# EAGLE design BUZZI-19d (EAGLE 4.15)

## Sheet 1 of 8
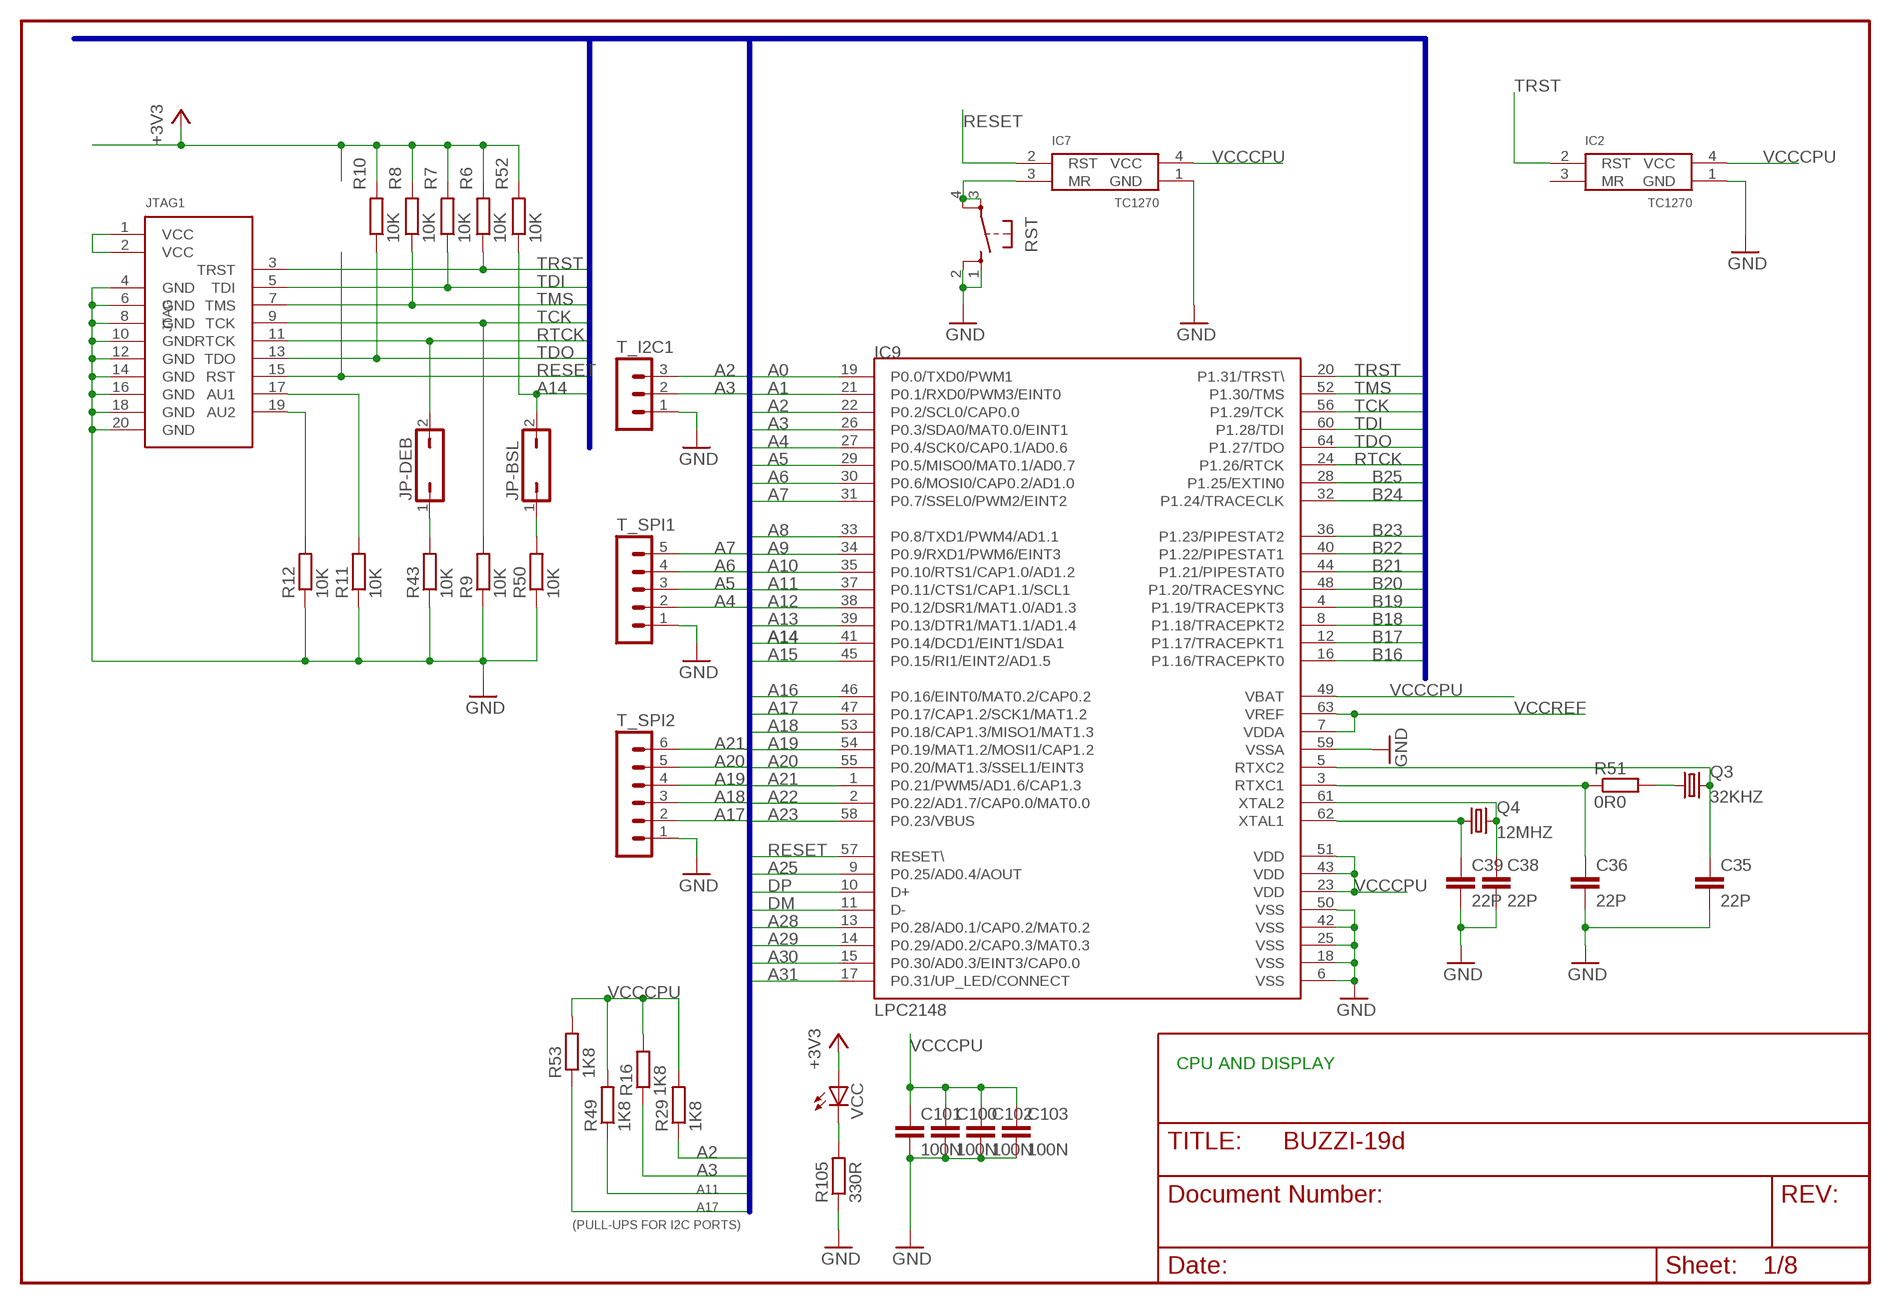
[diagram p0: schematic, sheet 1]

### Parts
C35  22P  C-EUC0805  [C0805]
C36  22P  C-EUC0805  [C0805]
C38  22P  C-EUC0805  [C0805]
C39  22P  C-EUC0805  [C0805]
C100  100N  C-EUC0805  [C0805]
C101  100N  C-EUC0805  [C0805]
C102  100N  C-EUC0805  [C0805]
C103  100N  C-EUC0805  [C0805]
IC2  TC1270  [SOT143R_INFINEON]
IC7  TC1270  [SOT143R_INFINEON]
IC9  LPC2148  LPC2148FBD64  [TSQFP50P1200X1200X160-64N]
JP-BSL  JP1Q  [JP1]
JP-DEB  JP1Q  [JP1]
JTAG1  ARM-JTAG  [ML20L]
Q3  32KHZ  CRYTALTC26V  [TC26V]
Q4  12MHZ  CRYTALHC49UP  [HC49UP]
R6  10K  R-EU_M0805  [M0805]
R7  10K  R-EU_M0805  [M0805]
R8  10K  R-EU_M0805  [M0805]
R9  10K  R-EU_M0805  [M0805]
R10  10K  R-EU_M0805  [M0805]
R11  10K  R-EU_M0805  [M0805]
R12  10K  R-EU_M0805  [M0805]
R16  1K8  R-EU_M0805  [M0805]
R29  1K8  R-EU_M0805  [M0805]
R43  10K  R-EU_M0805  [M0805]
R49  1K8  R-EU_M0805  [M0805]
R50  10K  R-EU_M0805  [M0805]
R51  0R0  R-EU_M0805  [M0805]
R52  10K  R-EU_M0805  [M0805]
R53  1K8  R-EU_M0805  [M0805]
R105  330R  R-EU_M0805  [M0805]
RST  10XX  [B3F-10XX]
T_I2C1  MA03-1  [MA03-1]
T_SPI1  MA05-1  [MA05-1]
T_SPI2  MA06-1  [MA06-1]
VCC  LEDCHIP-LED0805  [CHIP-LED0805]

### Nets
+3V3: R6.2 R7.2 R8.2 R10.2 R52.2 VCC.A ; also sheet 2,5,7,8
A0: IC9.19(P0.0/TXD0/PWM1)
A1: IC9.21(P0.1/RXD0/PWM3/EINT0) ; also sheet 7
A2: IC9.22(P0.2/SCL0/CAP0.0) R29.1 T_I2C1.3 ; also sheet 7
A3: IC9.26(P0.3/SDA0/MAT0.0/EINT1) R16.1 T_I2C1.2 ; also sheet 7
A4: IC9.27(P0.4/SCK0/CAP0.1/AD0.6) T_SPI1.2 ; also sheet 5
A5: IC9.29(P0.5/MISO0/MAT0.1/AD0.7) T_SPI1.3 ; also sheet 5
A6: IC9.30(P0.6/MOSI0/CAP0.2/AD1.0) T_SPI1.4 ; also sheet 5
A7: IC9.31(P0.7/SSEL0/PWM2/EINT2) T_SPI1.5 ; also sheet 5
A8: IC9.33(P0.8/TXD1/PWM4/AD1.1)
A9: IC9.34(P0.9/RXD1/PWM6/EINT3)
A10: IC9.35(P0.10/RTS1/CAP1.0/AD1.2)
A11: IC9.37(P0.11/CTS1/CAP1.1/SCL1) R49.1
A12: IC9.38(P0.12/DSR1/MAT1.0/AD1.3)
A13: IC9.39(P0.13/DTR1/MAT1.1/AD1.4)
A14: IC9.41(P0.14/DCD1/EINT1/SDA1) JP-BSL.2 R52.1
A15: IC9.45(P0.15/RI1/EINT2/AD1.5)
A16: IC9.46(P0.16/EINT0/MAT0.2/CAP0.2)
A17: IC9.47(P0.17/CAP1.2/SCK1/MAT1.2) R53.1 T_SPI2.2
A18: IC9.53(P0.18/CAP1.3/MISO1/MAT1.3) T_SPI2.3
A19: IC9.54(P0.19/MAT1.2/MOSI1/CAP1.2) T_SPI2.4
A20: IC9.55(P0.20/MAT1.3/SSEL1/EINT3) T_SPI2.5
A21: IC9.1(P0.21/PWM5/AD1.6/CAP1.3) T_SPI2.6
A22: IC9.2(P0.22/AD1.7/CAP0.0/MAT0.0)
A23: IC9.58(P0.23/VBUS) ; also sheet 2
A25: IC9.9(P0.25/AD0.4/AOUT)
A28: IC9.13(P0.28/AD0.1/CAP0.2/MAT0.2)
A29: IC9.14(P0.29/AD0.2/CAP0.3/MAT0.3)
A30: IC9.15(P0.30/AD0.3/EINT3/CAP0.0)
A31: IC9.17(P0.31/UP_LED/CONNECT) ; also sheet 2
B16: IC9.16(P1.16/TRACEPKT0)
B17: IC9.12(P1.17/TRACEPKT1)
B18: IC9.8(P1.18/TRACEPKT2)
B19: IC9.4(P1.19/TRACEPKT3)
B20: IC9.48(P1.20/TRACESYNC)
B21: IC9.44(P1.21/PIPESTAT0)
B22: IC9.40(P1.22/PIPESTAT1)
B23: IC9.36(P1.23/PIPESTAT2)
B24: IC9.32(P1.24/TRACECLK)
B25: IC9.28(P1.25/EXTIN0)
DM: IC9.11(D-) ; also sheet 2
DP: IC9.10(D+) ; also sheet 2
GND: C35.2 C36.2 C38.2 C39.2 C100.2 C101.2 C102.2 C103.2 IC2.1(GND) IC7.1(GND) IC9.6(VSS) IC9.18(VSS) IC9.25(VSS) IC9.42(VSS) IC9.50(VSS) IC9.59(VSSA) JTAG1.4(GND) JTAG1.6(GND) JTAG1.8(GND) JTAG1.10(GND) JTAG1.12(GND) JTAG1.14(GND) JTAG1.16(GND) JTAG1.18(GND) JTAG1.20(GND) R9.1 R11.1 R12.1 R43.1 R50.1 R105.1 RST.1 RST.2 T_I2C1.1 T_SPI1.1 T_SPI2.1 ; also sheet 2,5,7,8
JBSL: JP-BSL.1 R50.2
JDEB: JP-DEB.1 R43.2
JTAG17: JTAG1.17(AU1) R11.2
JTAG19: JTAG1.19(AU2) R12.2
MRSWITCH: IC7.3(MR) RST.3 RST.4
N$1: JTAG1.1(VCC) JTAG1.2(VCC)
RESET: IC7.2(RST) IC9.57(RESET\) JTAG1.15(RST)
RTCK: IC9.24(P1.26/RTCK) JP-DEB.2 JTAG1.11(RTCK)
RX1: C36.1 IC9.3(RTXC1) R51.1
RX2: C35.1 IC9.5(RTXC2) Q3.2
RX3: Q3.1 R51.2
TCK: IC9.56(P1.29/TCK) JTAG1.9(TCK) R9.2
TDI: IC9.60(P1.28/TDI) JTAG1.5(TDI) R7.1
TDO: IC9.64(P1.27/TDO) JTAG1.13(TDO) R10.1
TMS: IC9.52(P1.30/TMS) JTAG1.7(TMS) R8.1
TRST: IC2.2(RST) IC9.20(P1.31/TRST\) JTAG1.3(TRST) R6.1
VCCCPU: C100.1 C101.1 C102.1 C103.1 IC2.4(VCC) IC7.4(VCC) IC9.23(VDD) IC9.43(VDD) IC9.49(VBAT) IC9.51(VDD) R16.2 R29.2 R49.2 R53.2 ; also sheet 8
VCCLED: R105.2 VCC.C
VCCREF: IC9.7(VDDA) IC9.63(VREF) ; also sheet 8
X1: C39.1 IC9.62(XTAL1) Q4.1
X2: C38.1 IC9.61(XTAL2) Q4.2
Unconnected: IC2.3(MR)

### Buses
ARM7:A[0..31],B[0..31],RESET,DP,DM,TRST,TMS,TCK,TDI,TDO,RTCK

### Notes on the sheet
- CPU AND DISPLAY
- (PULL-UPS FOR I2C PORTS)

## Sheet 2 of 8
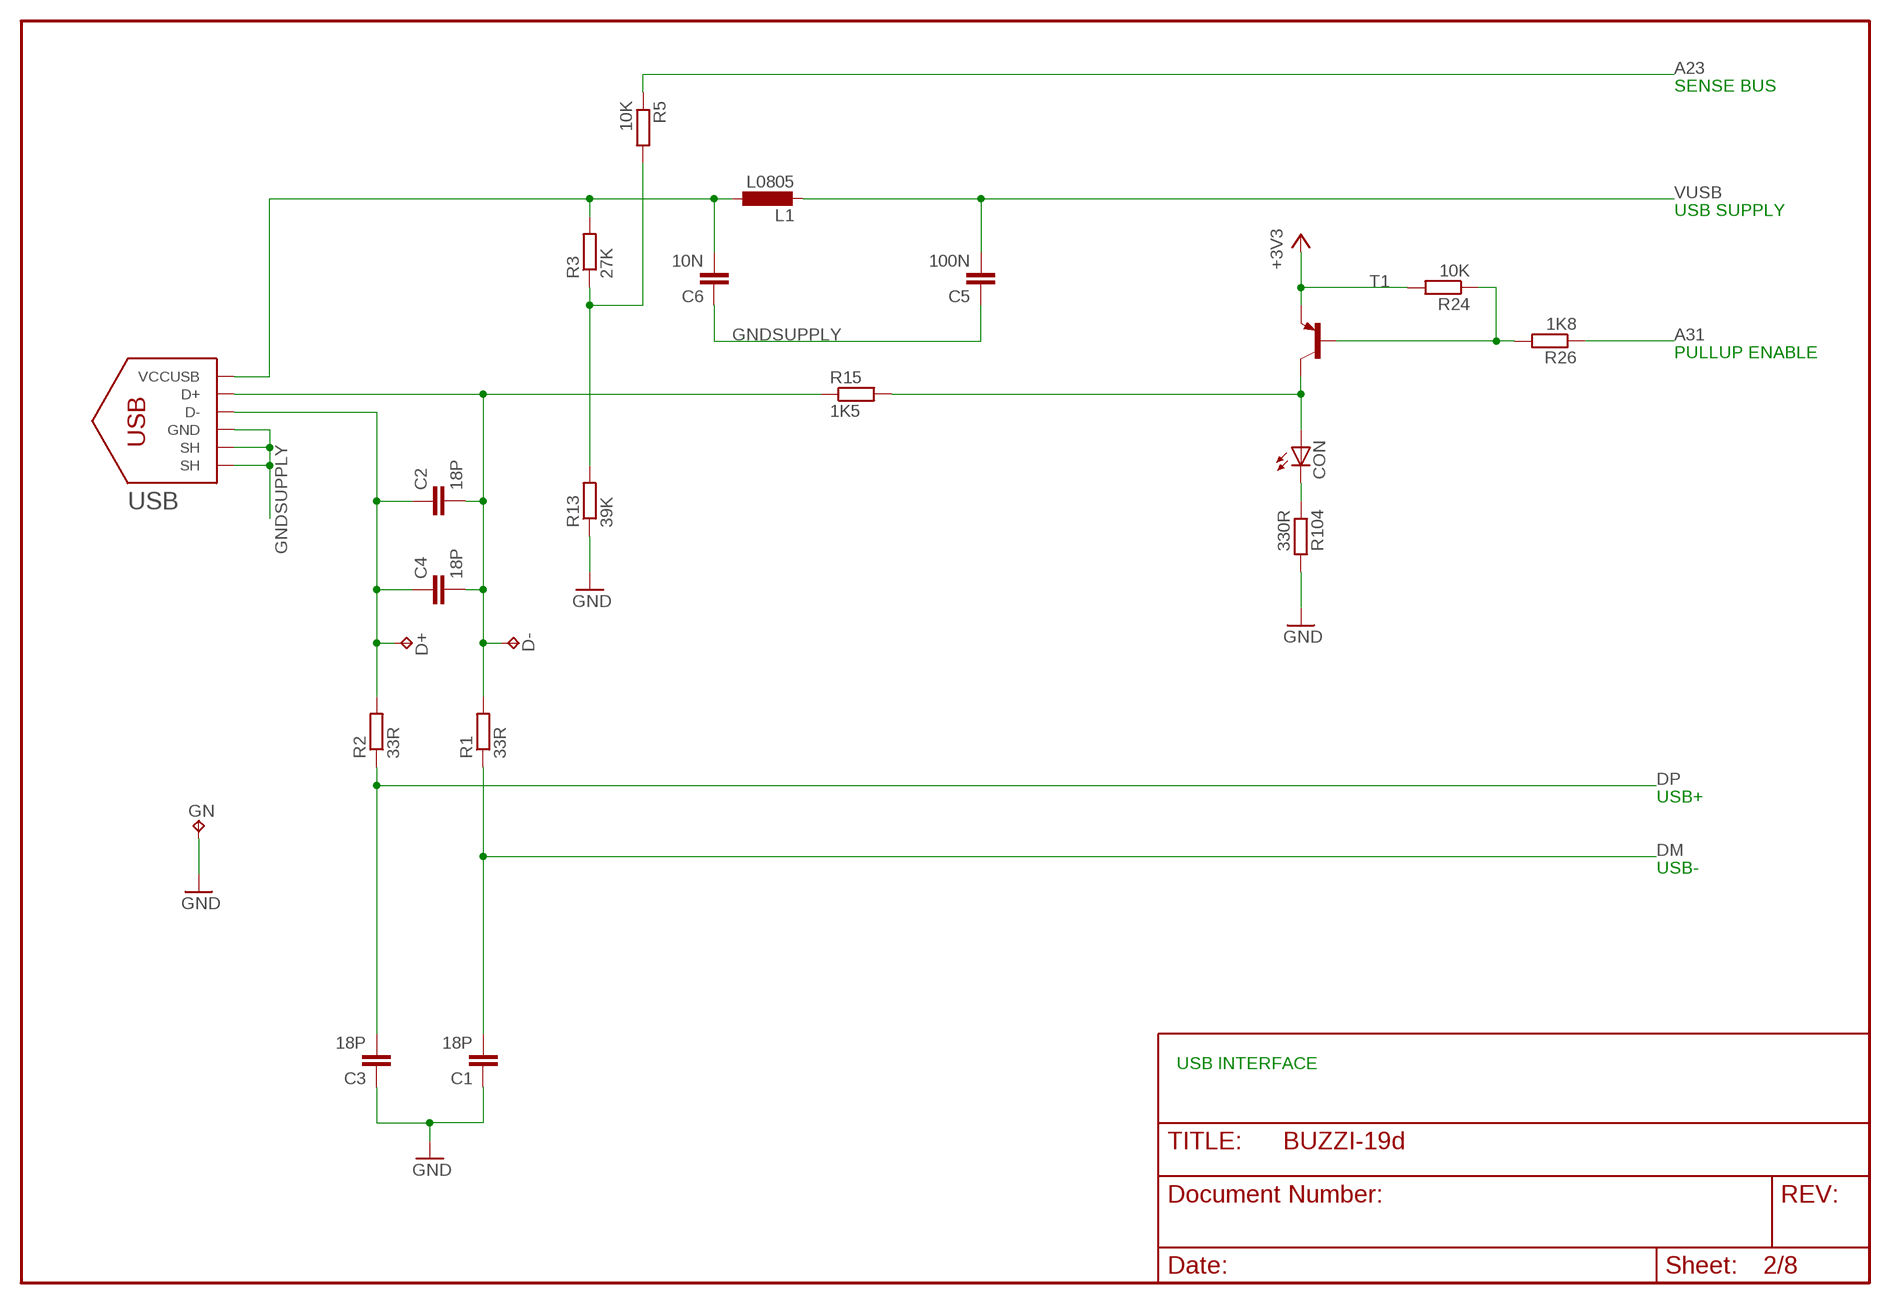
[diagram p1: schematic, sheet 2]

### Parts
C1  18P  C-EUC0805  [C0805]
C2  18P  C-EUC0805  [C0805]
C3  18P  C-EUC0805  [C0805]
C4  18P  C-EUC0805  [C0805]
C5  100N  C-EUC0805  [C0805]
C6  10N  C-EUC0805  [C0805]
CON  LEDCHIP-LED0805  [CHIP-LED0805]
D+  TPPAD1-13  [P1-13]
D-  TPPAD1-13  [P1-13]
GN  TPPAD1-13  [P1-13]
L1  L0805  [C0805]
R1  33R  R-EU_M0805  [M0805]
R2  33R  R-EU_M0805  [M0805]
R3  27K  R-EU_M0805  [M0805]
R5  10K  R-EU_M0805  [M0805]
R13  39K  R-EU_M0805  [M0805]
R15  1K5  R-EU_M0805  [M0805]
R24  10K  R-EU_M0805  [M0805]
R26  1K8  R-EU_M0805  [M0805]
R104  330R  R-EU_M0805  [M0805]
T1  BC857A-PNP-SOT23-BEC  [SOT23-BEC]
USB  USBCONNMINI-B-HOLE  [USB-MB-H]

### Nets
+3V3: R24.2 T1.E ; also sheet 1,5,7,8
A23: R5.1 ; also sheet 1
A31: R26.1 ; also sheet 1
CONLED: CON.C R104.1
D+: C2.1 C4.1 D+.1(TP) R2.2 USB.D-
D+PULLUP1: CON.A R15.2 T1.C
D+PULLUP2: R24.1 R26.2 T1.B
D-: C2.2 C4.2 D-.1(TP) R1.2 R15.1 USB.D+
DM: C1.2 R1.1 ; also sheet 1
DP: C3.2 R2.1 ; also sheet 1
GND: C1.1 C3.1 GN.1(TP) R13.1 R104.2 ; also sheet 1,5,7,8
GNDSUPPLY [supply]: C5.1 C6.1 USB.GND USB.GND@1(SH) USB.GND@2(SH) ; also sheet 8
USBSENSE: R3.1 R5.2 R13.2
VCCUSB1 [supply]: C6.2 L1.1 R3.2 USB.VBUS(VCCUSB)
VUSB [supply]: C5.2 L1.2 ; also sheet 8

### Notes on the sheet
- SENSE BUS
- USB SUPPLY
- PULLUP ENABLE
- USB+
- USB-
- USB INTERFACE

## Sheet 3 of 8
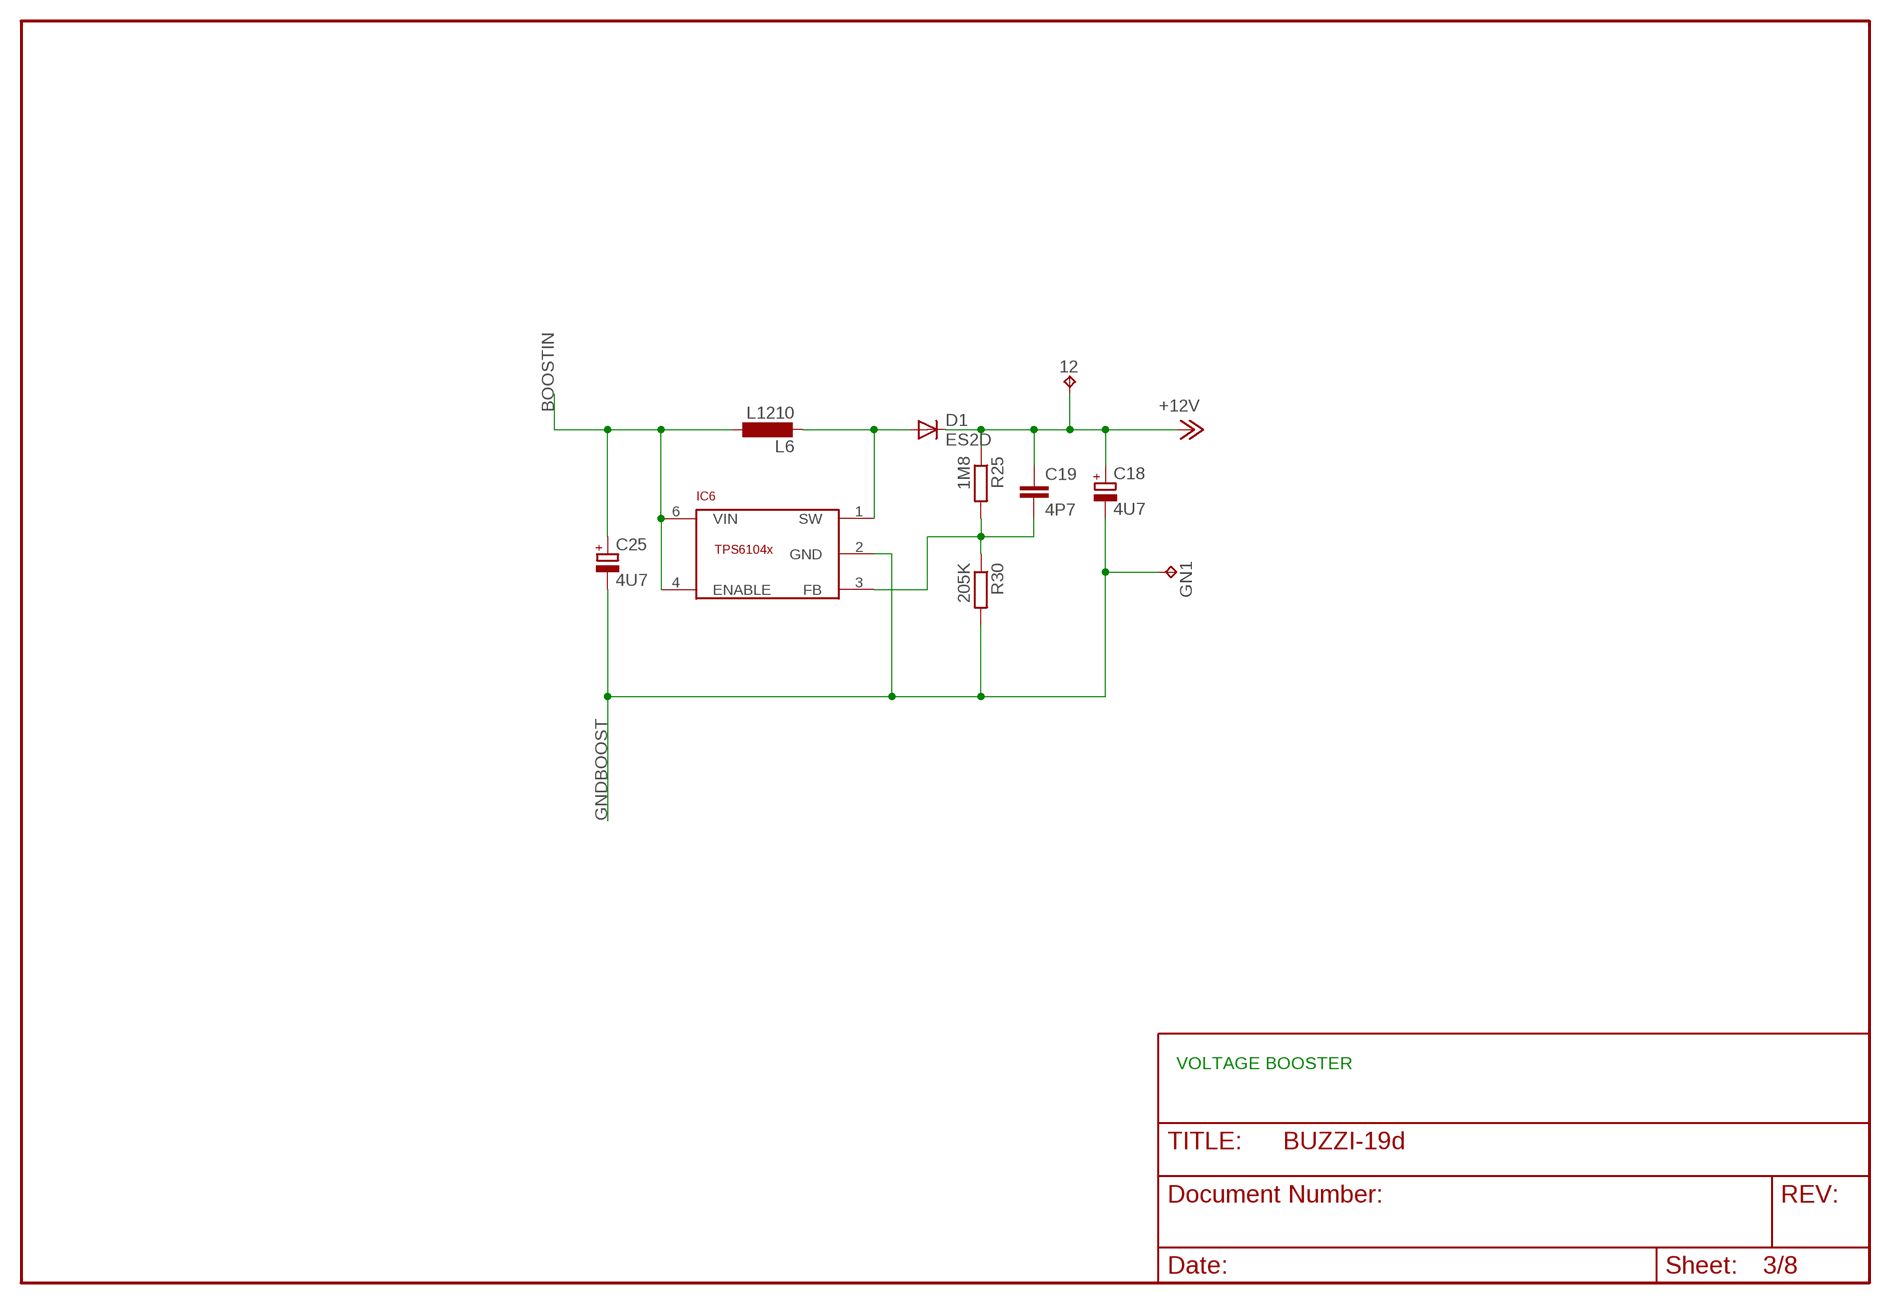
[diagram p2: schematic, sheet 3]

### Parts
12  TPPAD1-13  [P1-13]
C18  4U7  CPOL-EUCT3528  [CT3528]
C19  4P7  C-EUC0805  [C0805]
C25  4U7  CPOL-EUCT3528  [CT3528]
D1  ES2D  [SMB]
GN1  TPPAD1-13  [P1-13]
IC6  TPS6104X  [SOT23-6L]
L6  L1210  [C1210]
R25  1M8  R-EU_M0805  [M0805]
R30  205K  R-EU_M0805  [M0805]

### Nets
12: 12.1(TP) C18.+ C19.1 D1.C R25.1 ; supply symbol labelled +12V
BOOST2: D1.A IC6.1(SW) L6.2
BOOST3: C19.2 IC6.3(FB) R25.2 R30.1
BOOSTIN: C25.+ IC6.4(ENABLE) IC6.6(VIN) L6.1 ; also sheet 8
GNDBOOST [supply]: C18.- C25.- GN1.1(TP) IC6.2(GND) R30.2 ; also sheet 8

### Notes on the sheet
- VOLTAGE BOOSTER

## Sheet 4 of 8
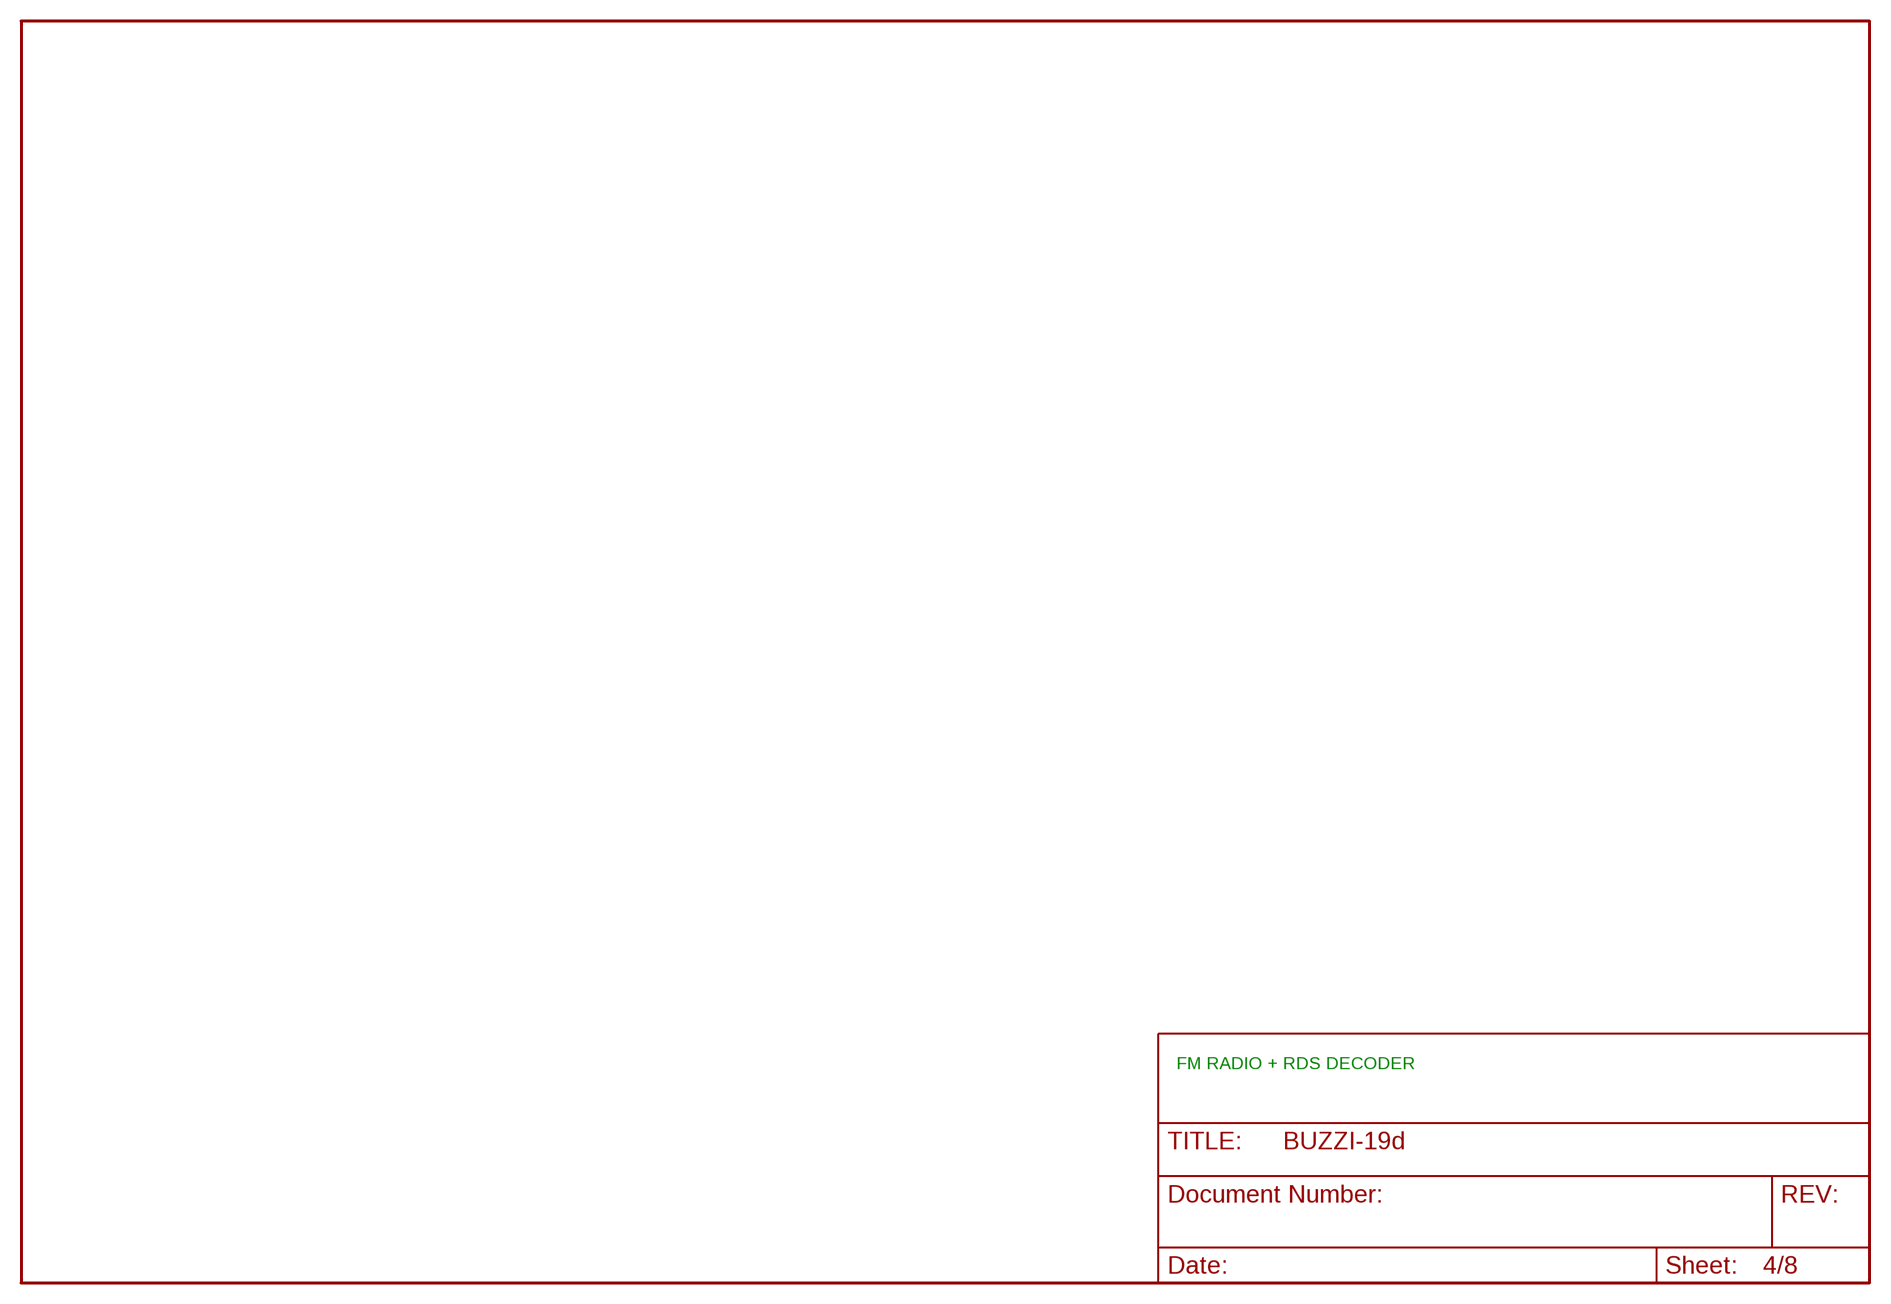
[diagram p3: schematic, sheet 4]

### Notes on the sheet
- FM RADIO + RDS DECODER

## Sheet 5 of 8
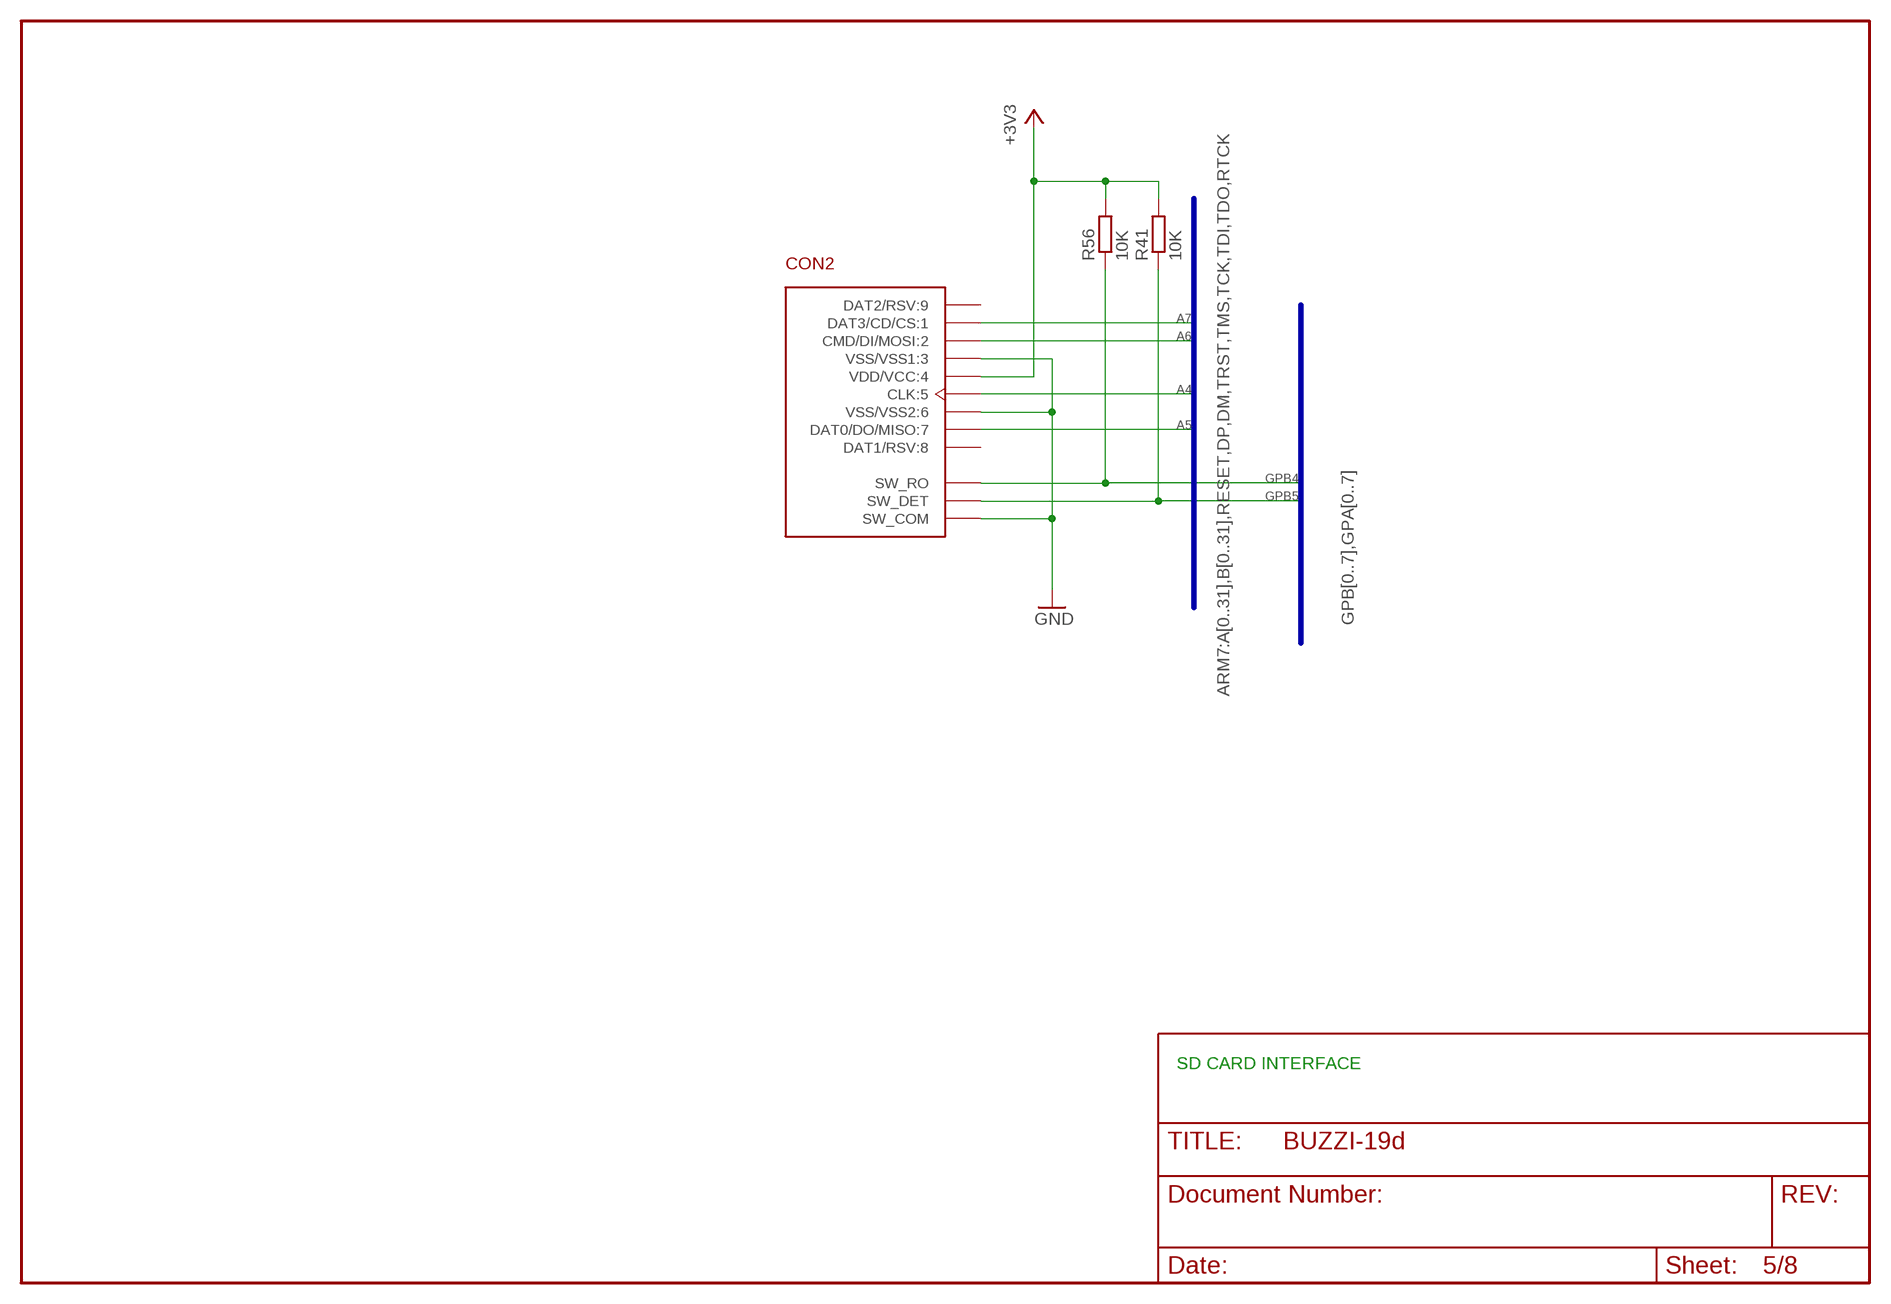
[diagram p4: schematic, sheet 5]

### Parts
CON2  SDSLOT  [HIROSE_DM1A]
R41  10K  R-EU_M0805  [M0805]
R56  10K  R-EU_M0805  [M0805]

### Nets
+3V3: CON2.P$4(VDD/VCC:4) R41.2 R56.2 ; also sheet 1,2,7,8
A4: CON2.P$5(CLK:5) ; also sheet 1
A5: CON2.P$7(DAT0/DO/MISO:7) ; also sheet 1
A6: CON2.P$2(CMD/DI/MOSI:2) ; also sheet 1
A7: CON2.P$1(DAT3/CD/CS:1) ; also sheet 1
GND: CON2.P$3(VSS/VSS1:3) CON2.P$6(VSS/VSS2:6) CON2.P$SWGND(SW_COM) ; also sheet 1,2,7,8
GPB4: CON2.P$SWRO(SW_RO) R56.1 ; also sheet 7
GPB5: CON2.P$SWDET(SW_DET) R41.1 ; also sheet 7
Unconnected: CON2.P$8(DAT1/RSV:8) CON2.P$9(DAT2/RSV:9)

### Buses
ARM7:A[0..31],B[0..31],RESET,DP,DM,TRST,TMS,TCK,TDI,TDO,RTCK
GPB[0..7],GPA[0..7]

### Notes on the sheet
- SD CARD INTERFACE

## Sheet 6 of 8
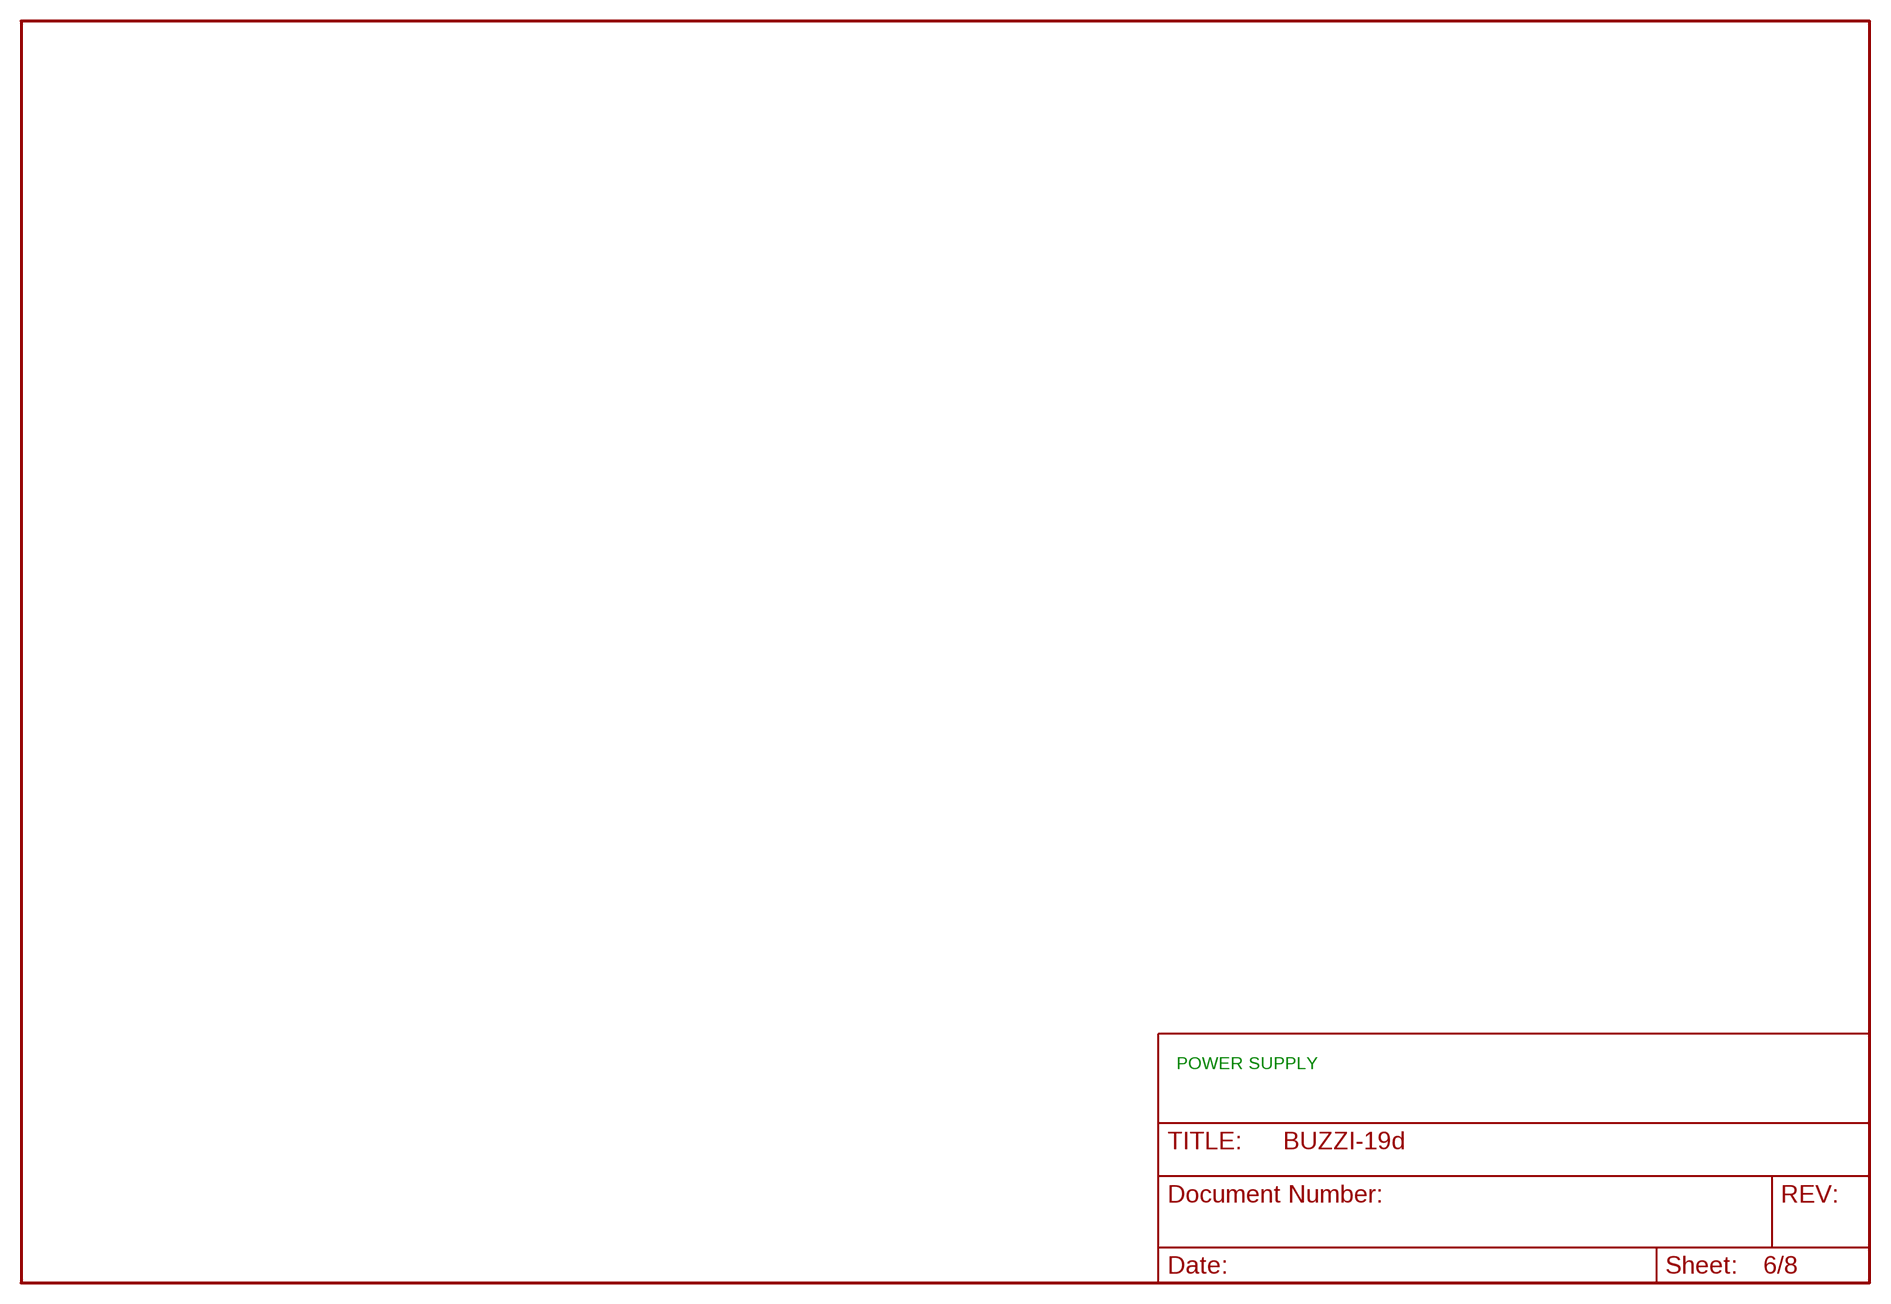
[diagram p5: schematic, sheet 6]

### Notes on the sheet
- POWER SUPPLY

## Sheet 7 of 8
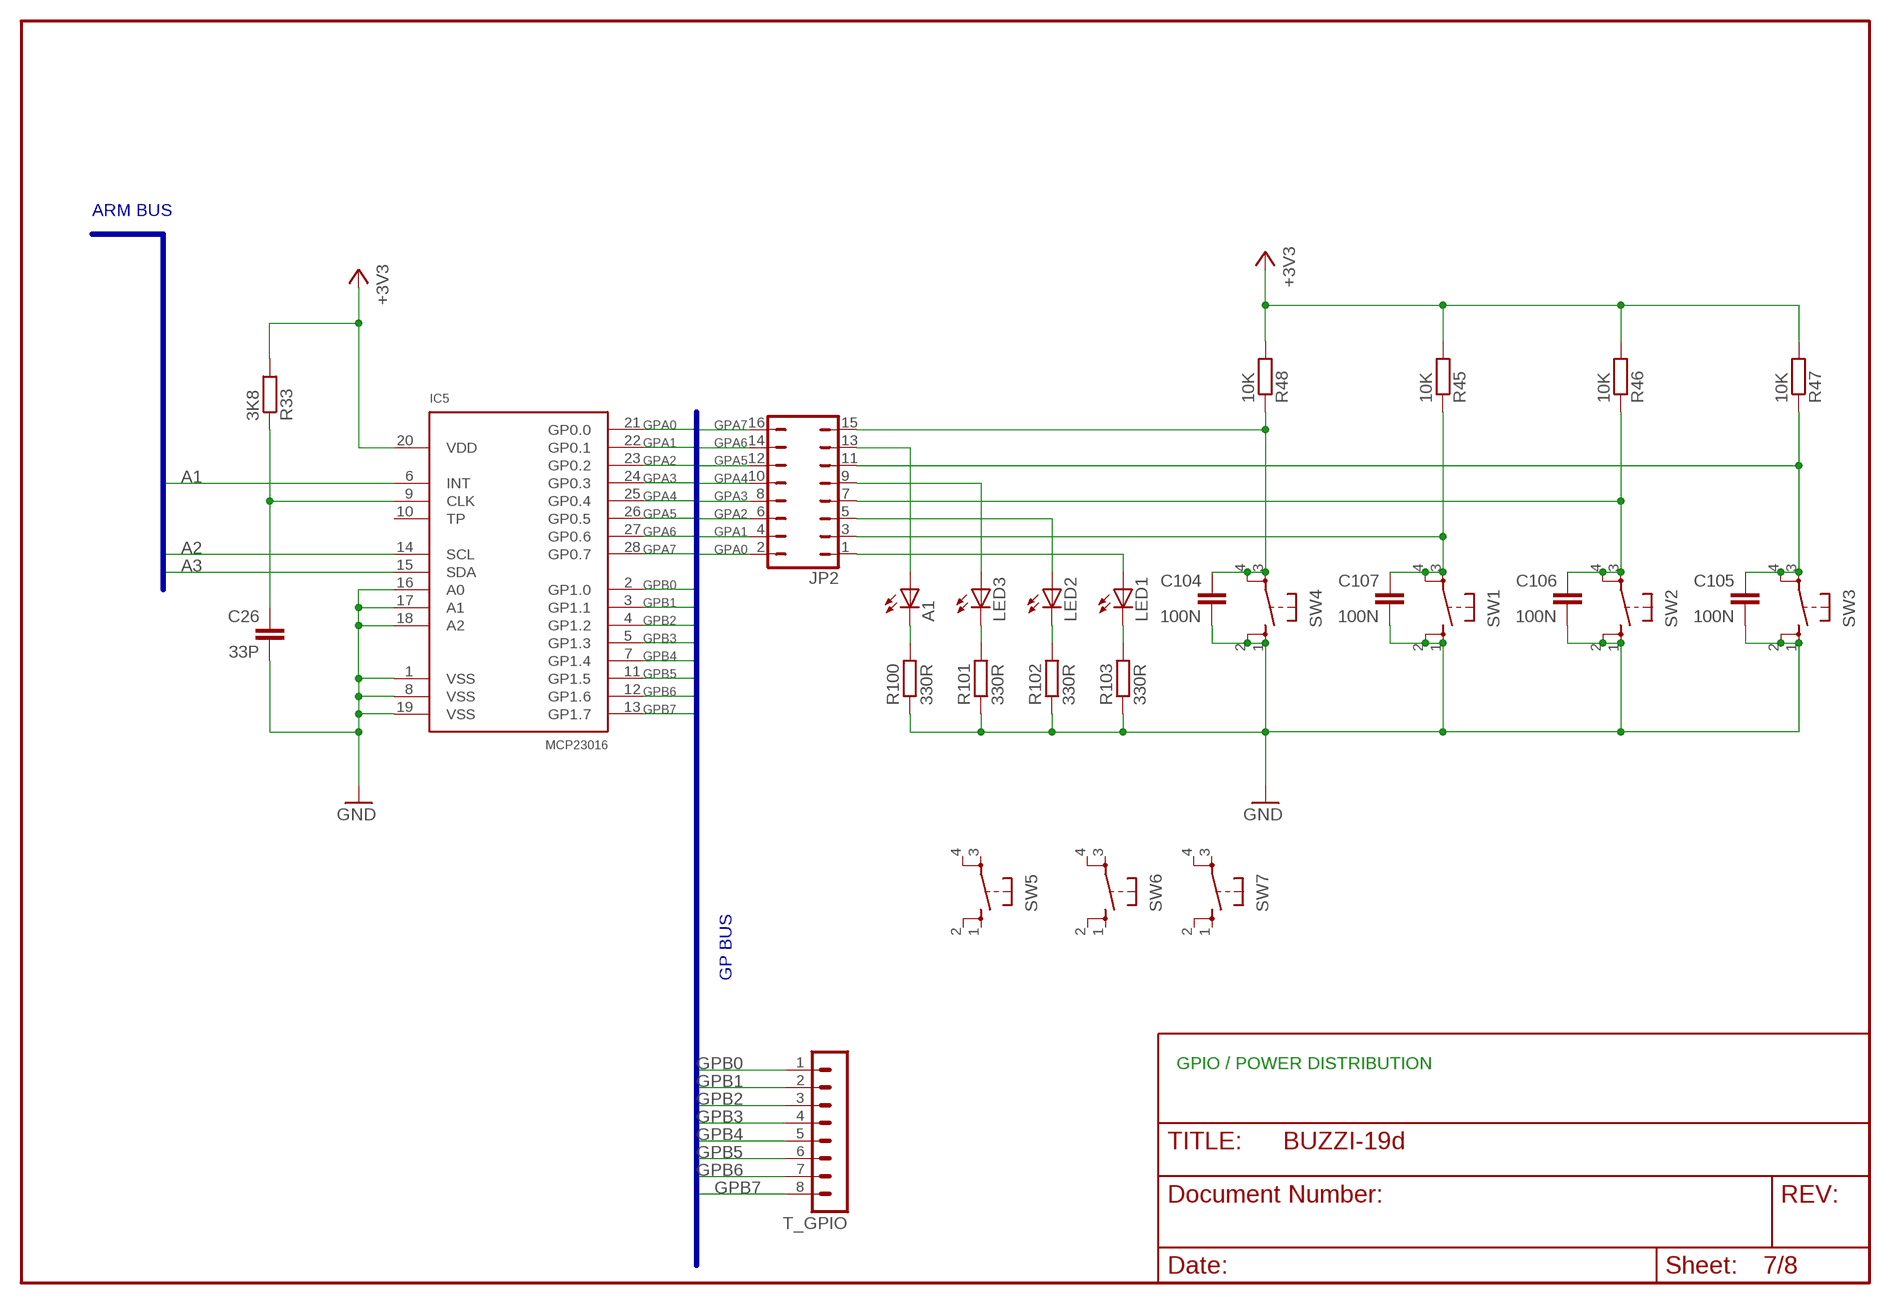
[diagram p6: schematic, sheet 7]

### Parts
A1  LEDCHIP-LED0805  [CHIP-LED0805]
C26  33P  C-EUC0805  [C0805]
C104  100N  C-EUC0805  [C0805]
C105  100N  C-EUC0805  [C0805]
C106  100N  C-EUC0805  [C0805]
C107  100N  C-EUC0805  [C0805]
IC5  MCP23016  [SSOP28]
JP2  JP8Q  [JP8Q]
LED1  LEDCHIP-LED0805  [CHIP-LED0805]
LED2  LEDCHIP-LED0805  [CHIP-LED0805]
LED3  LEDCHIP-LED0805  [CHIP-LED0805]
R33  3K8  R-EU_M0805  [M0805]
R45  10K  R-EU_M0805  [M0805]
R46  10K  R-EU_M0805  [M0805]
R47  10K  R-EU_M0805  [M0805]
R48  10K  R-EU_M0805  [M0805]
R100  330R  R-EU_M0805  [M0805]
R101  330R  R-EU_M0805  [M0805]
R102  330R  R-EU_M0805  [M0805]
R103  330R  R-EU_M0805  [M0805]
SW1  10XX  [B3F-10XX]
SW2  10XX  [B3F-10XX]
SW3  10XX  [B3F-10XX]
SW4  10XX  [B3F-10XX]
SW5  10XX  [B3F-10XX]
SW6  10XX  [B3F-10XX]
SW7  10XX  [B3F-10XX]
T_GPIO  MA08-1  [MA08-1]

### Nets
+3V3: IC5.20(VDD) R33.2 R45.2 R46.2 R47.2 R48.2 ; also sheet 1,2,5,8
A1: IC5.6(INT) ; also sheet 1
A1LED4: LED2.C R102.2
A1LED5: LED3.C R101.2
A2: IC5.14(SCL) ; also sheet 1
A3: IC5.15(SDA) ; also sheet 1
B25KEY1: C107.1 JP2.3 R45.1 SW1.3 SW1.4
B25KEY2: C106.1 JP2.7 R46.1 SW2.3 SW2.4
B25KEY3: C105.1 JP2.11 R47.1 SW3.3 SW3.4
B25KEY4: C104.1 JP2.15 R48.1 SW4.3 SW4.4
GND: C26.2 C104.2 C105.2 C106.2 C107.2 IC5.1(VSS) IC5.8(VSS) IC5.16(A0) IC5.17(A1) IC5.18(A2) IC5.19(VSS) R100.1 R101.1 R102.1 R103.1 SW1.1 SW1.2 SW2.1 SW2.2 SW3.1 SW3.2 SW4.1 SW4.2 ; also sheet 1,2,5,8
GPA0: IC5.21(GP0.0) JP2.2
GPA1: IC5.22(GP0.1) JP2.4
GPA2: IC5.23(GP0.2) JP2.6
GPA3: IC5.24(GP0.3) JP2.8
GPA4: IC5.25(GP0.4) JP2.10
GPA5: IC5.26(GP0.5) JP2.12
GPA6: IC5.27(GP0.6) JP2.14
GPA7: IC5.28(GP0.7) JP2.16
GPB0: IC5.2(GP1.0) T_GPIO.1 ; also sheet 8
GPB1: IC5.3(GP1.1) T_GPIO.2 ; also sheet 8
GPB2: IC5.4(GP1.2) T_GPIO.3 ; also sheet 8
GPB3: IC5.5(GP1.3) T_GPIO.4 ; also sheet 8
GPB4: IC5.7(GP1.4) T_GPIO.5 ; also sheet 5
GPB5: IC5.11(GP1.5) T_GPIO.6 ; also sheet 5
GPB6: IC5.12(GP1.6) T_GPIO.7
GPB7: IC5.13(GP1.7) T_GPIO.8
LED1: LED1.C R103.2
LED4: A1.C R100.2
N$5: JP2.1 LED1.A
N$6: JP2.5 LED2.A
N$7: JP2.9 LED3.A
N$8: A1.A JP2.13
N$9: C26.1 IC5.9(CLK) R33.1
Unconnected: IC5.10(TP) SW5.1 SW5.2 SW5.3 SW5.4 SW6.1 SW6.2 SW6.3 SW6.4 SW7.1 SW7.2 SW7.3 SW7.4

### Buses
ARM7:A[0..31],B[0..31],RESET,DP,DM,TRST,TMS,TCK,TDI,TDO,RTCK
GPB[0..7],GPA[0..7]

### Notes on the sheet
- ARM BUS
- GP BUS
- GPIO / POWER DISTRIBUTION

## Sheet 8 of 8
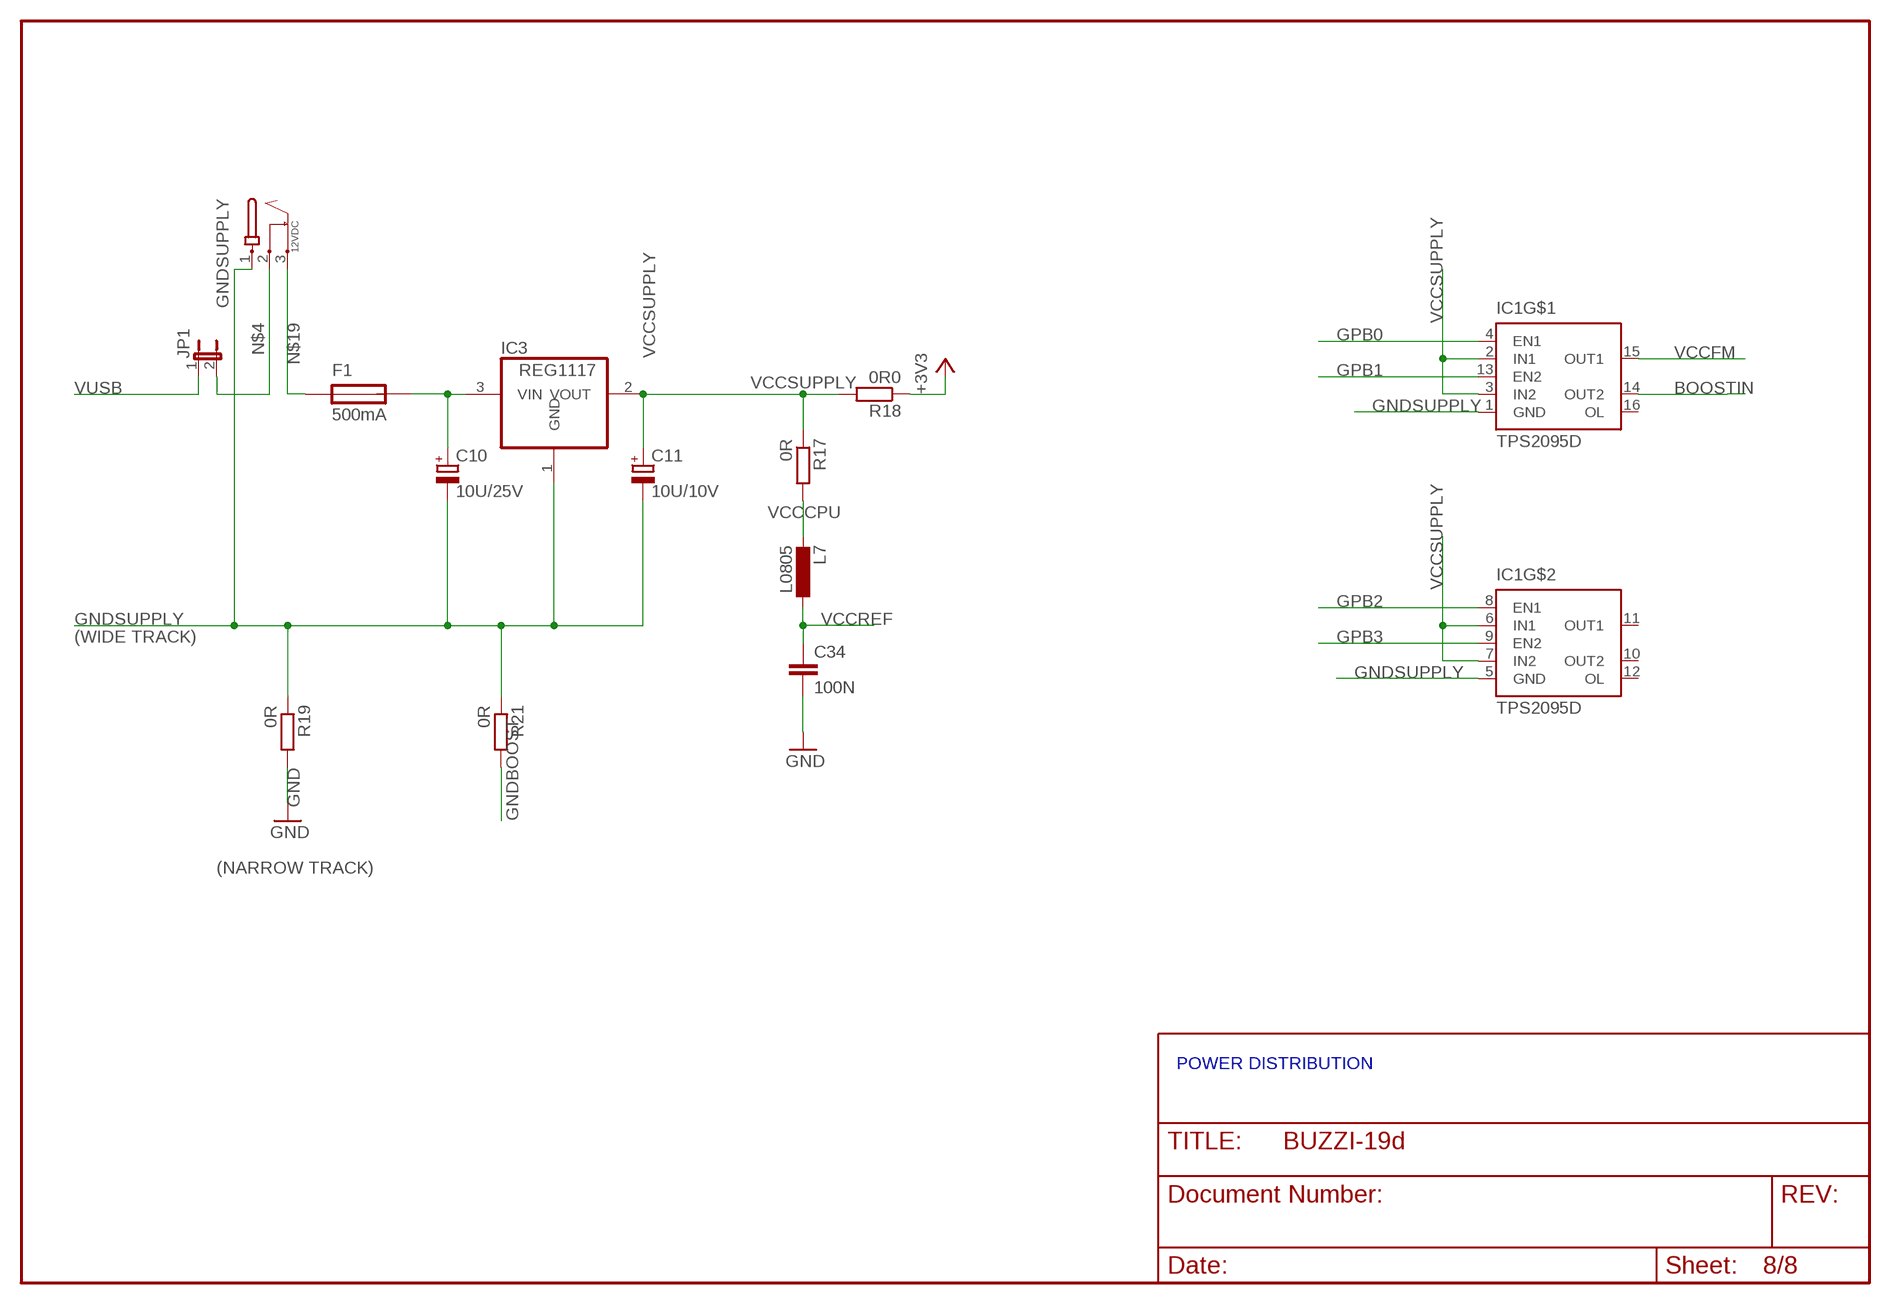
[diagram p7: schematic, sheet 8]

### Parts
12VDC  JACK-PMS  [JACK-PMS]
C10  10U/25V  CPOL-EUCT7343  [CT7343]
C11  10U/10V  CPOL-EUCT3528  [CT3528]
C34  100N  C-EUC0805  [C0805]
F1  500mA  FUSE  [C1206]
IC1  TPS2095D  [SO16]
IC3  REG1117  [SOT223]
JP1  JP1E  [JP1]
L7  L0805  [C0805]
R17  0R  R-EU_M0805  [M0805]
R18  0R0  R-EU_M0805  [M0805]
R19  0R  R-EU_M0805  [M0805]
R21  0R  R-EU_M0805  [M0805]

### Nets
+3V3: R18.1 ; also sheet 1,2,5,7
BOOSTIN: IC1.14(OUT2) ; also sheet 3
GND: C34.2 R19.2 ; also sheet 1,2,5,7
GNDBOOST [supply]: R21.2 ; also sheet 3
GNDSUPPLY [supply]: 12VDC.1 C10.- C11.- IC1.1(GND) IC1.5(GND) IC3.1(GND) R19.1 R21.1 ; also sheet 2
GPB0: IC1.4(EN1) ; also sheet 7
GPB1: IC1.13(EN2) ; also sheet 7
GPB2: IC1.8(EN1) ; also sheet 7
GPB3: IC1.9(EN2) ; also sheet 7
N$4 [supply]: 12VDC.2 JP1.2
N$19 [supply]: 12VDC.3 F1.1
V5V [supply]: C10.+ F1.2 IC3.3(VIN)
VCCCPU: L7.2 R17.2 ; also sheet 1
VCCFM: IC1.15(OUT1)
VCCREF: C34.1 L7.1 ; also sheet 1
VCCSUPPLY [supply]: C11.+ IC1.2(IN1) IC1.3(IN2) IC1.6(IN1) IC1.7(IN2) IC3.2(VOUT) R17.1 R18.2
VUSB [supply]: JP1.1 ; also sheet 2
Unconnected: IC1.10(OUT2) IC1.11(OUT1) IC1.12(OL) IC1.16(OL)

### Notes on the sheet
- (WIDE TRACK)
- (NARROW TRACK)
- POWER DISTRIBUTION

## Library data of the parts
12 D+ D- GN GN1 = testpad:TP
12VDC = POWER-IN:JACK-PMS
A1 CON LED1-LED3 VCC = led:LED: LED OSRAM: - CHIPLED LG R971, LG N971, LY N971, LG Q971, LY Q971, LO R971, LY R971 LH N974, LH R974 LS Q976, LO Q976, LY Q976 LO Q996 - Hyper CHIPLED LW Q18S LB Q993, LB Q99A, LB R99A - SideLED LS A670, LO A670, LY A670, LG A670, LP A670 LB A673, LV A673, LT A673, LW A673 LH A674 LY A675 LS A676, LA A676, LO A676, LY A676, LW A676 LS A679, LY A679, LG A679 - Hyper Micro SIDELED® LS Y876, LA Y876, LO Y876, LY Y876 LT Y87S - SmartLED LW L88C, LW L88S LB L89C, LB L89S, LG L890 LS L89K, LO L89K, LY L89K LS L896, LA L896, LO L896, LY L896 - TOPLED LS T670, LO T670, LY T670, LG T670, LP T670 LSG T670, LSP T670, LSY T670, LOP T670, LYG T670 LG T671, LOG T671, LSG T671 LB T673, LV T673, LT T673, LW T673 LH T674 LS T676, LA T676, LO T676, LY T676, LB T676, LH T676, LSB T676, LW T676 LB T67C, LV T67C, LT T67C, LS T67K, LO T67K, LY T67K, LW E67C LS E67B, LA E67B, LO E67B, LY E67B, LB E67C, LV E67C, LT E67C LW T67C LS T679, LY T679, LG T679 LS T770, LO T770, LY T770, LG T770, LP T770 LB T773, LV T773, LT T773, LW T773 LH T774 LS E675, LA E675, LY E675, LS T675 LS T776, LA T776, LO T776, LY T776, LB T776 LHGB T686 LT T68C, LB T68C - Hyper Mini TOPLED® LB M676 - Mini TOPLED Santana® LG M470 LS M47K, LO M47K, LY M47K Source: http://www.osram.convergy.de/
C1-C6 C19 C26 C34-C36 C38 C39 C100-C107 = rcl:C-EU: CAPACITOR, European symbol
C10 C11 C18 C25 = rcl:CPOL-EU: POLARIZED CAPACITOR, European symbol
CON2 = turbod3:SDSLOT
D1 = diode:ES2D: DIODE super fast rectifier, 2 A
F1 = turbod3:FUSE
IC1 = turbod3:TPS2095D
IC2 IC7 = turbod3:TC1270
IC3 = burr-brown:REG1117: 800mA and 1A Low Dropout (LDO) Positive Regulator 1.8V, 2.5V, 2.85V, 3.3V, 5V, and Adj
IC5 = turbod3:MCP23016
IC6 = turbod3:TPS6104X
IC9 = philips-5:LPC2148
JP1 = jumper:JP1E: JUMPER
JP2 = jumper:JP8Q: JUMPER
JP-BSL JP-DEB = jumper:JP1Q: JUMPER
JTAG1 = turbod3:ARM-JTAG
L1 L6 L7 = turbod3:L
Q3 = crystal:CRYTAL: CRYSTAL
Q4 = turbod3:CRYTAL: CRYSTAL
R1-R3 R5-R13 R15-R19 R21 R24-R26 R29 R30 R33 R41 R43 R45-R53 R56 R100-R105 = rcl:R-EU_: RESISTOR, European symbol
RST SW1-SW7 = KEY_B:10XX
T1 = transistor:*-PNP-: PNP Transistror
T_GPIO = con-lstb:MA08-1: PIN HEADER
T_I2C1 = con-lstb:MA03-1: PIN HEADER
T_SPI1 = con-lstb:MA05-1: PIN HEADER
T_SPI2 = con-lstb:MA06-1: PIN HEADER
USB = turbod3:USBCONN

## Net classes
1 supply: width 0.5 mm

## Board
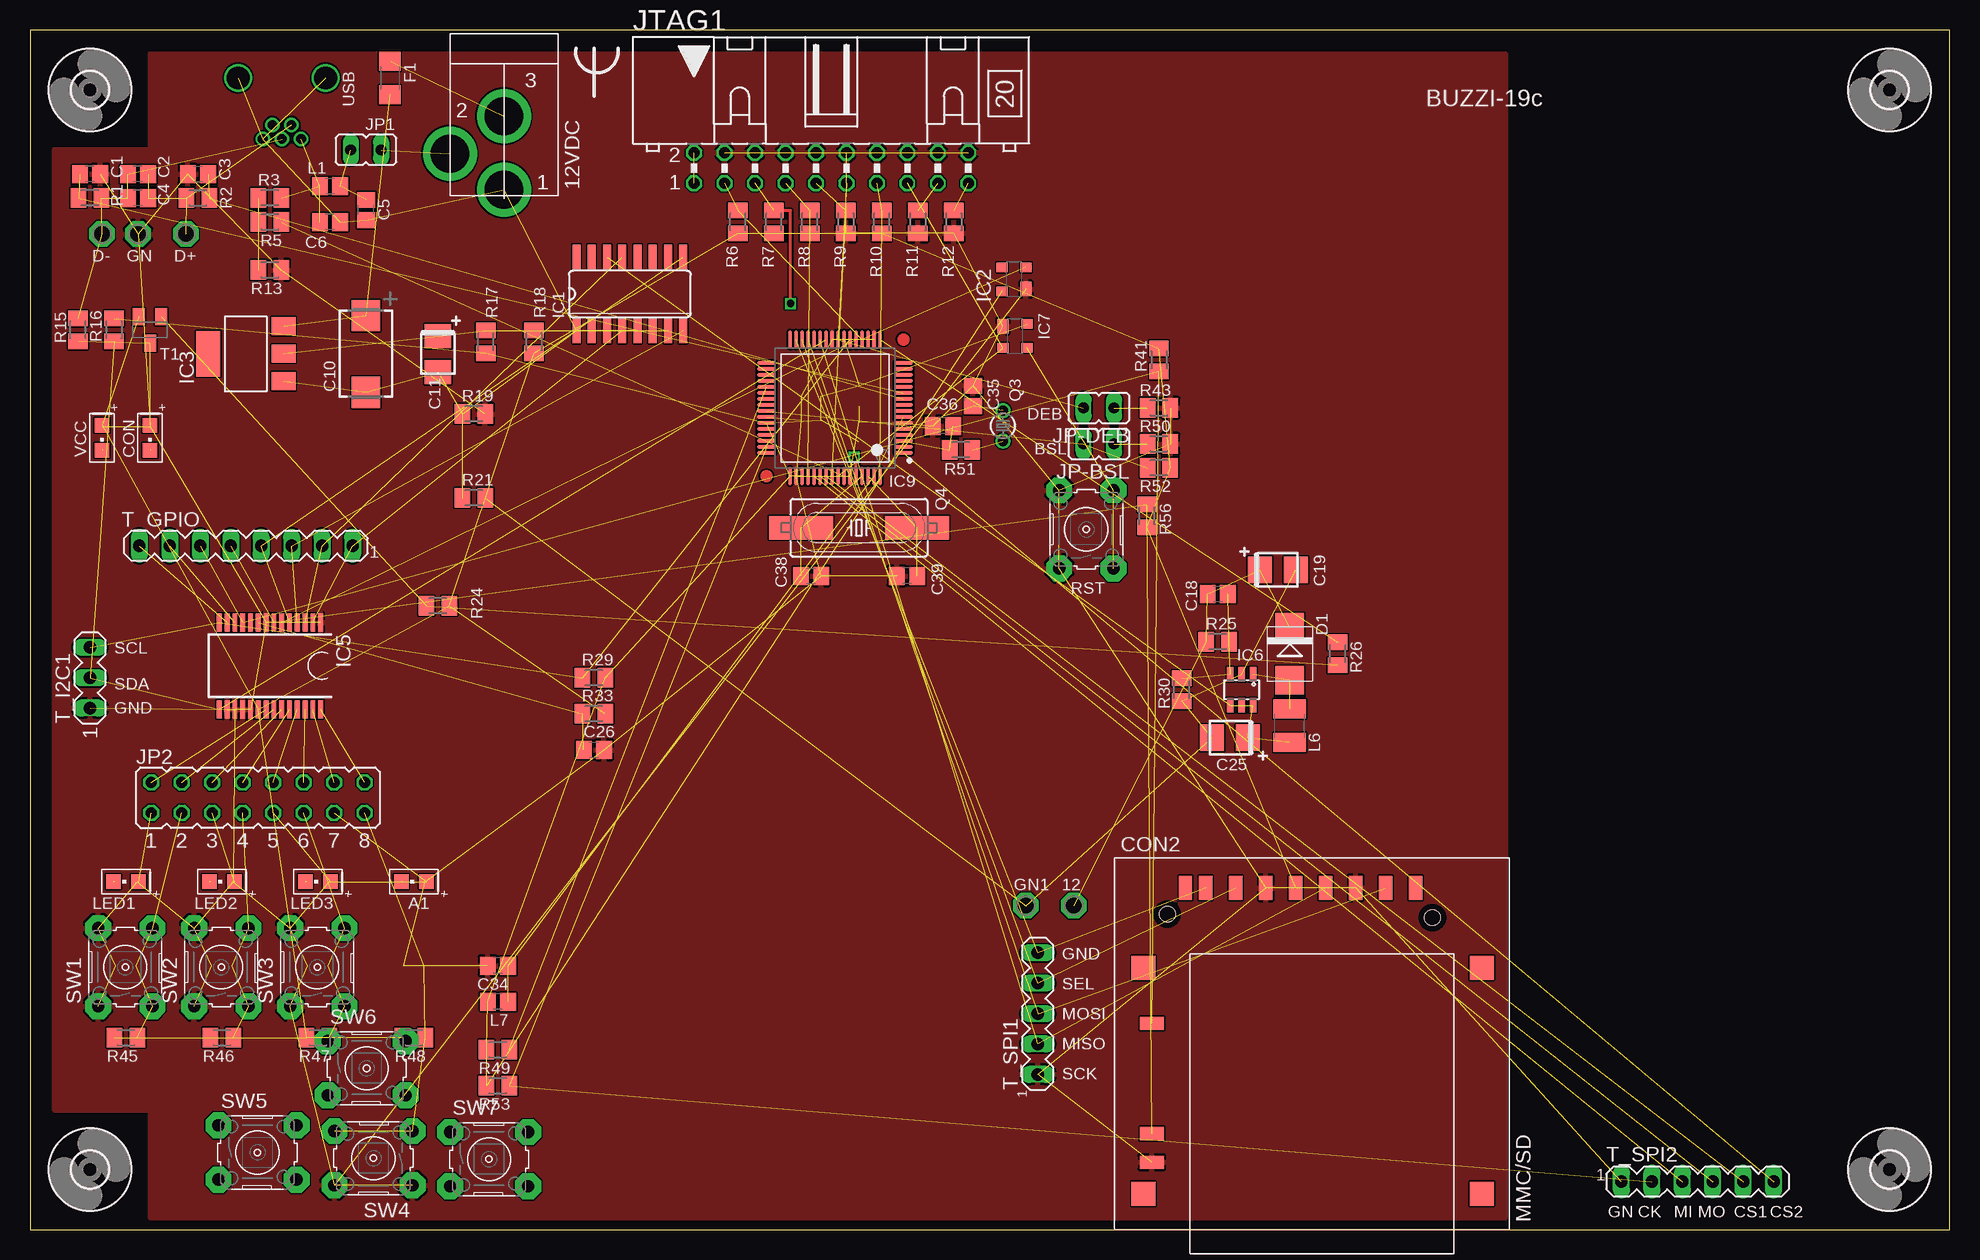
[diagram p8: board, top side]
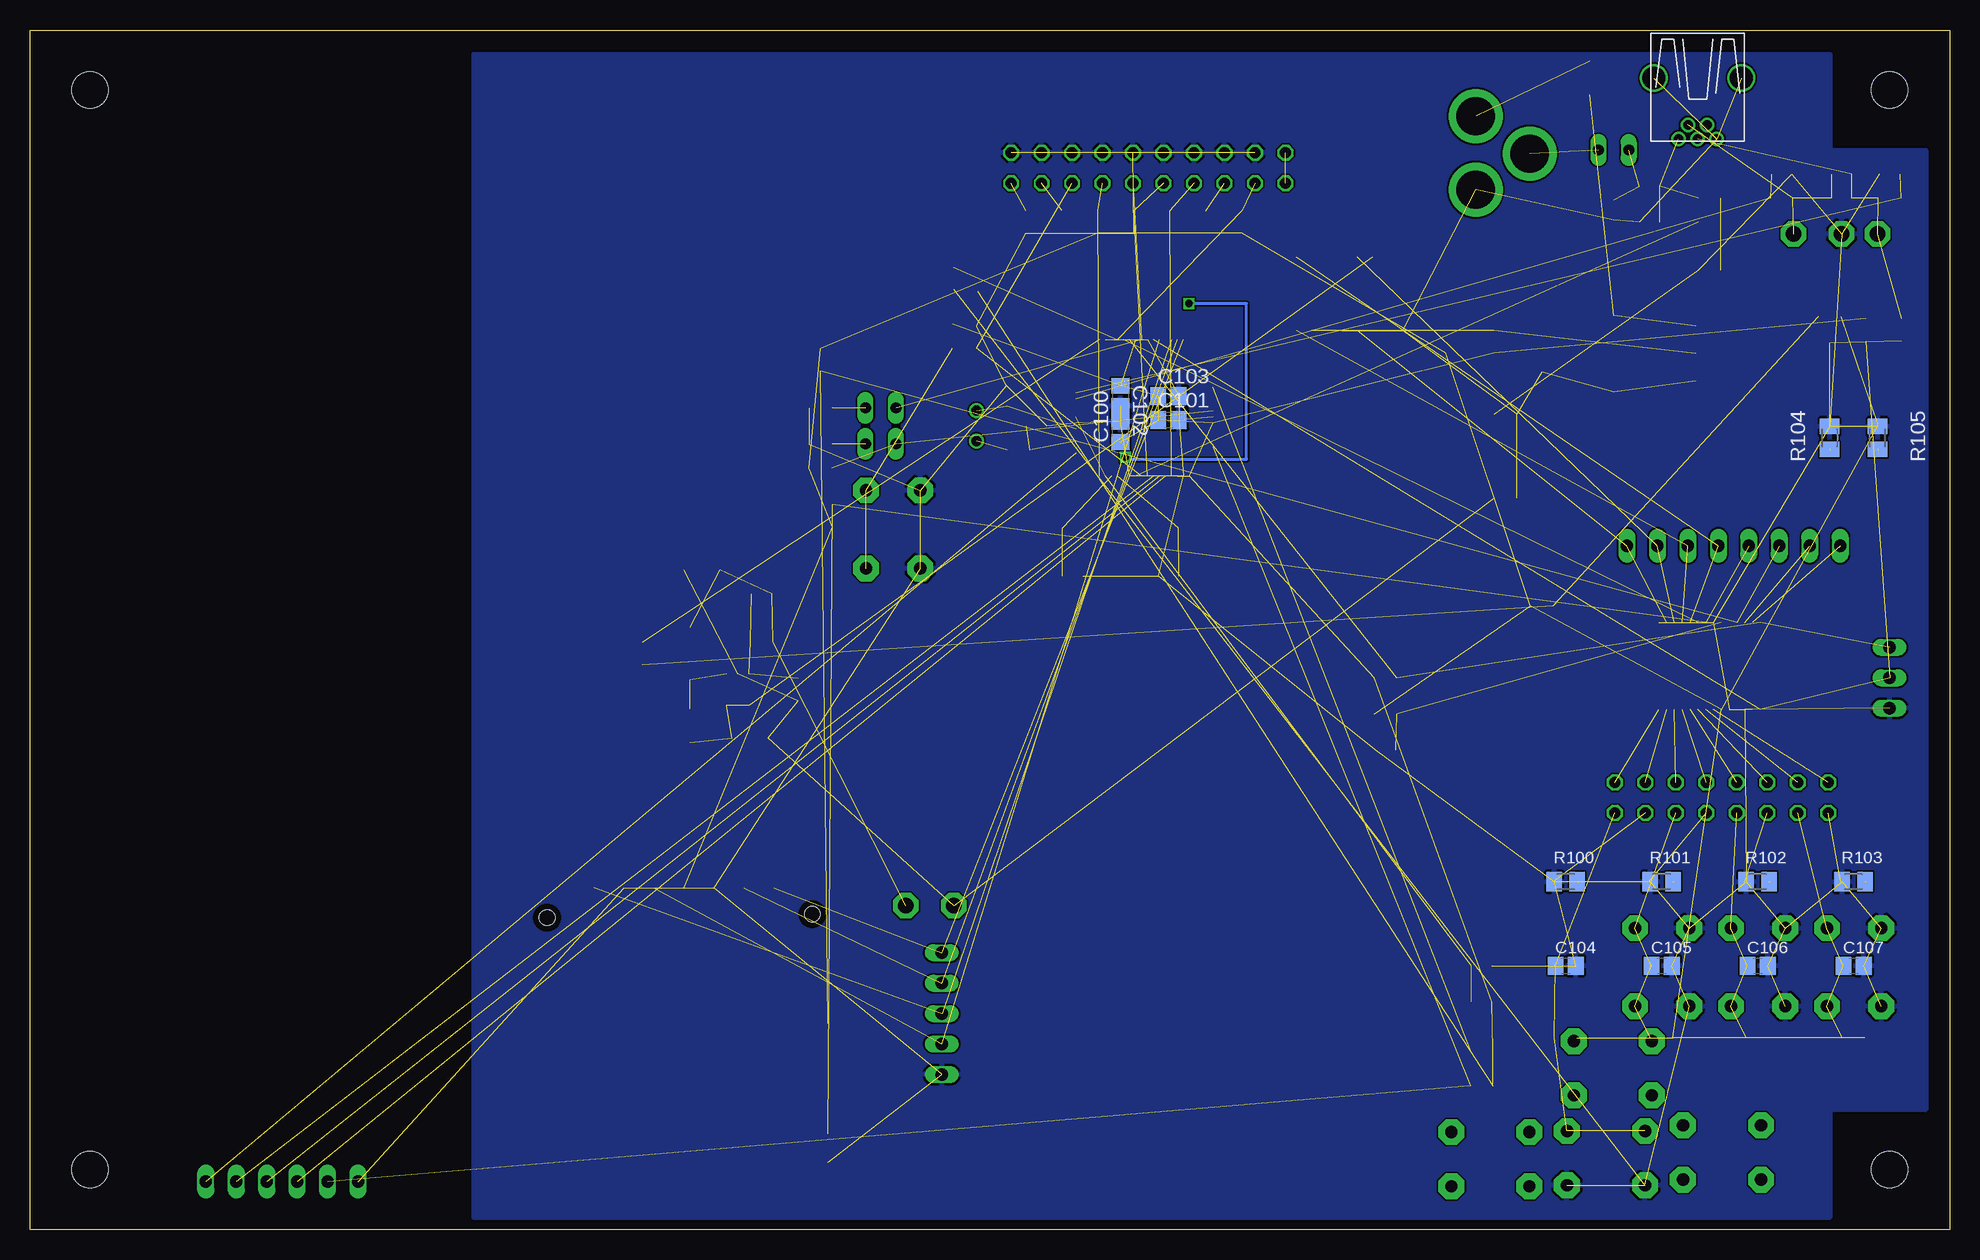
[diagram p9: board, bottom side, seen from below]

Size 160 x 100 mm. Coordinates in mm from the lower left corner, seen from the top.
Outline: 0,0 160,0 160,100 0,100 0,0
Copper layers (1*16): Top 0.035mm / dielectric 1.5mm / Bottom 0.035mm
Design rules "PCB-POOL": minimum track width 6mil, minimum drill 12mil, track to track 6mil, track to pad 6mil, pad to pad 6mil, via to via 6mil, smd to smd 6mil, copper to edge 20mil, drill to drill 8mil, minimum pad ring 8mil, minimum via ring 6mil, stop-mask expansion 3mil, vias tented up to drill 1mil, thermal gap 8mil

### Footprints (pad centres in the part's own frame; a part is rotated, then mirrored left to right if it is on the bottom)
P1-13 = drill 1.321 pad 2.159 octagon: 1 0,0
JACK-PMS = drill 3.2 pad 4.5 round: 1 -0.5,-3.31; 2 -5,-0.31; 3 -0.5,2.809
CHIP-LED0805 = smd 1.2 x 1.2: A 0,-1.05; C 0,1.05
C0805 = smd 1.3 x 1.5: 1 -0.85,0; 2 0.85,0
CT7343 = smd 2.6 x 2.4: + 3.2,0; - -3.2,0
CT3528 = smd 2 x 2.2: + 1.5,0; - -1.5,0
HIROSE_DM1A = smd 1.1 x 2: P$1 -10,2.5; P$2 -7.5,2.5; P$3 -5,2.5; P$4 -2.5,2.5; P$5 0,2.5; P$6 2.5,2.5; P$7 5,2.5; P$8 7.5,2.5; P$9 -11.7,2.5 | smd 2 x 2: P$SH1 -15.2,-4.2; P$SH2 -15.2,-23; P$SH3 13,-4.2; P$SH4 13,-23 | smd 2 x 1.1: P$SWDET -14.5,-8.8; P$SWGND -14.5,-20.4; P$SWRO -14.5,-18 | hole 1.3: -13.2,0.3; 8.89,0
SMB = smd 2.4 x 2.4: A 2.2,0; C -2.2,0
C1206 = smd 1.6 x 1.8: 1 -1.4,0; 2 1.4,0
SO16 = smd 0.66 x 2.032: 1 -4.445,-3.073; 2 -3.175,-3.073; 3 -1.905,-3.073; 4 -0.635,-3.073; 5 0.635,-3.073; 6 1.905,-3.073; 7 3.175,-3.073; 8 4.445,-3.073; 9 4.445,3.073; 10 3.175,3.073; 11 1.905,3.073; 12 0.635,3.073; 13 -0.635,3.073; 14 -1.905,3.073; 15 -3.175,3.073; 16 -4.445,3.073
SOT143R_INFINEON = smd 1.2 x 0.9: 1 -0.8,-1 | smd 0.8 x 0.9: 2 1,-1; 3 1,1; 4 -1,1
SOT223 = smd 1.499 x 2.007: 1 -2.261,-3.15; 2 0.025,-3.15; 3 2.311,-3.15 | smd 3.81 x 2.007: 4 0,3.15
SSOP28 = smd 0.4 x 1.5: 1 -4.225,-3.625; 2 -3.575,-3.625; 3 -2.925,-3.625; 4 -2.275,-3.625; 5 -1.625,-3.625; 6 -0.975,-3.625; 7 -0.325,-3.625; 8 0.325,-3.625; 9 0.975,-3.625; 10 1.625,-3.625; 11 2.275,-3.625; 12 2.925,-3.625; 13 3.575,-3.625; 14 4.225,-3.625; 15 4.225,3.625; 16 3.575,3.625; 17 2.925,3.625; 18 2.275,3.625; 19 1.625,3.625; 20 0.975,3.625; 21 0.325,3.625; 22 -0.325,3.625; 23 -0.975,3.625; 24 -1.625,3.625; 25 -2.275,3.625; 26 -2.925,3.625; 27 -3.575,3.625; 28 -4.225,3.625
SOT23-6L = smd 0.55 x 1.2: 1 -0.95,-1.3; 2 0,-1.3; 3 0.95,-1.3; 4 0.95,1.3; 5 0,1.3; 6 -0.95,1.3
TSQFP50P1200X1200X160-64N = smd 1.55 x 0.3: 1 -5.7,3.75; 2 -5.7,3.25; 3 -5.7,2.75; 4 -5.7,2.25; 5 -5.7,1.75; 6 -5.7,1.25; 7 -5.7,0.75; 8 -5.7,0.25; 9 -5.7,-0.25; 10 -5.7,-0.75; 11 -5.7,-1.25; 12 -5.7,-1.75; 13 -5.7,-2.25; 14 -5.7,-2.75; 15 -5.7,-3.25; 16 -5.7,-3.75; 33 5.7,-3.75; 34 5.7,-3.25; 35 5.7,-2.75; 36 5.7,-2.25; 37 5.7,-1.75; 38 5.7,-1.25; 39 5.7,-0.75; 40 5.7,-0.25; 41 5.7,0.25; 42 5.7,0.75; 43 5.7,1.25; 44 5.7,1.75; 45 5.7,2.25; 46 5.7,2.75; 47 5.7,3.25; 48 5.7,3.75 | smd 0.3 x 1.55: 17 -3.75,-5.7; 18 -3.25,-5.7; 19 -2.75,-5.7; 20 -2.25,-5.7; 21 -1.75,-5.7; 22 -1.25,-5.7; 23 -0.75,-5.7; 24 -0.25,-5.7; 25 0.25,-5.7; 26 0.75,-5.7; 27 1.25,-5.7; 28 1.75,-5.7; 29 2.25,-5.7; 30 2.75,-5.7; 31 3.25,-5.7; 32 3.75,-5.7; 49 3.75,5.7; 50 3.25,5.7; 51 2.75,5.7; 52 2.25,5.7; 53 1.75,5.7; 54 1.25,5.7; 55 0.75,5.7; 56 0.25,5.7; 57 -0.25,5.7; 58 -0.75,5.7; 59 -1.25,5.7; 60 -1.75,5.7; 61 -2.25,5.7; 62 -2.75,5.7; 63 -3.25,5.7; 64 -3.75,5.7
JP1 = drill 0.914 long: 1 0,-1.27; 2 0,1.27
JP8Q = drill 0.914 octagon: 1 -8.89,-1.27; 2 -8.89,1.27; 3 -6.35,-1.27; 4 -6.35,1.27; 5 -3.81,-1.27; 6 -3.81,1.27; 7 -1.27,-1.27; 8 -1.27,1.27; 9 1.27,-1.27; 10 1.27,1.27; 11 3.81,-1.27; 12 3.81,1.27; 13 6.35,-1.27; 14 6.35,1.27; 15 8.89,-1.27; 16 8.89,1.27
ML20L = drill 0.914 octagon: 1 -11.43,-1.27; 2 -11.43,1.27; 3 -8.89,-1.27; 4 -8.89,1.27; 5 -6.35,-1.27; 6 -6.35,1.27; 7 -3.81,-1.27; 8 -3.81,1.27; 9 -1.27,-1.27; 10 -1.27,1.27; 11 1.27,-1.27; 12 1.27,1.27; 13 3.81,-1.27; 14 3.81,1.27; 15 6.35,-1.27; 16 6.35,1.27; 17 8.89,-1.27; 18 8.89,1.27; 19 11.43,-1.27; 20 11.43,1.27
C1210 = smd 1.6 x 2.7: 1 -1.4,0; 2 1.4,0
TC26V = drill 0.813 round: 1 -1.27,0; 2 1.27,0
HC49UP = smd 5.334 x 1.93: 1 -4.826,0; 2 4.826,0
M0805 = smd 1.3 x 1.6: 1 -0.95,0; 2 0.95,0
B3F-10XX = drill 1.016 pad 2.159 octagon: 1 -3.379,2.312; 2 3.123,2.312; 3 -3.379,-2.209; 4 3.123,-2.209
SOT23-BEC = smd 1 x 1.4: B -0.95,-1.1; C 0,1.1; E 0.95,-1.1
MA08-1 = drill 1.016 long: 1 -8.89,0; 2 -6.35,0; 3 -3.81,0; 4 -1.27,0; 5 1.27,0; 6 3.81,0; 7 6.35,0; 8 8.89,0
MA03-1 = drill 1.016 long: 1 -2.54,0; 2 0,0; 3 2.54,0
MA05-1 = drill 1.016 long: 1 -5.08,0; 2 -2.54,0; 3 0,0; 4 2.54,0; 5 5.08,0
MA06-1 = drill 1.016 long: 1 -6.35,0; 2 -3.81,0; 3 -1.27,0; 4 1.27,0; 5 3.81,0; 6 6.35,0
3,0 = hole 3: 0,0
USB-MB-H = drill 0.8 round: D+ 5.1,0; D- 3.9,0.8; GND 5.1,-1.6; ID 3.9,-0.8; VBUS 5.1,1.6 | drill 1.9 round: GND@1 0,3.65; GND@2 0,-3.65

### Placement (x,y rotation side)
12  87,27 0 top
12VDC  40,90 0 top
A1  32,29 90 top
C1  5,88 180 top
C2  9,88 180 top
C3  14,88 0 top
C4  9,86 180 top
C5  28,85 90 top
C6  25,84 180 top
C10  28,73 90 top
C11  34,73 90 top
C18  104,55 180 top
C19  99,53 0 top
C25  100,41 0 top
C26  47,40 0 top
C34  39,22 180 top
C35  78.6,69.5 90 top
C36  76.1,67 180 top
C38  65.1,54.5 0 top
C39  73.1,54.5 180 top
C100  69.1,66.5 90 bottom
C101  65.1,67.5 0 bottom
C102  69.1,69.5 270.4 bottom
C103  65.1,69.5 0 bottom
C104  32,22 0 bottom
C105  24,22 0 bottom
C106  16,22 0 bottom
C107  8,22 0 bottom
CON  10,66 180 top
CON2  108,26 0 top
D1  105,48 270 top
D+  13,83 180 top
D-  6,83 180 top
F1  30,96 270 top
GN  9,83 180 top
GN1  83,27 0 top
IC1  50,78 0 top
IC2  82.02,79.21 90 top
IC3  18,73 90 top
IC5  20,47 180 top
IC6  101,45 180 top
IC7  82.1,74.5 270 top
IC9  67.1,68.5 180 top
JP1  28,90 270 top
JP2  19,36 0 top
JP-BSL  89.1,65.5 90 top
JP-DEB  89.1,68.5 90 top
JTAG1  66.78,88.49 0 top
L1  25,87 0 top
L6  105,42 90 top
L7  39,19 180 top
LED1  8,29 90 top
LED2  16,29 90 top
LED3  24,29 90 top
Q3  81.1,67 90 top
Q4  69.1,58.5 180 top
R1  5,86 0 top
R2  14,86 180 top
R3  20,86 0 top
R5  20,84 180 top
R6  59,84 270 top
R7  62,84 270 top
R8  65,84 270 top
R9  68,84 90 top
R10  71,84 270 top
R11  74,84 90 top
R12  77,84 90 top
R13  20,80 180 top
R15  4,75 270 top
R16  7,75 90 top
R17  38,74 270 top
R18  42,74 90 top
R19  37,68 0 top
R21  37,61 0 top
R24  34,52 0 top
R25  99,49 0 top
R26  109,48 270 top
R29  47,46 0 top
R30  96,45 270 top
R33  47,43 0 top
R41  94.1,72.5 90 top
R43  94.1,68.5 180 top
R45  8,16 180 top
R46  16,16 180 top
R47  24,16 180 top
R48  32,16 180 top
R49  39,15 180 top
R50  94.1,65.5 180 top
R51  77.6,65 0 top
R52  94.1,63.5 0 top
R53  39,12 180 top
R56  93.1,59.5 270 top
R100  32,29 0 bottom
R101  24,29 0 bottom
R102  16,29 0 bottom
R103  8,29 0 bottom
R104  10,66 90 bottom
R105  6,66 270 bottom
RST  88.1,58.5 90 top
SW1  8,22 90 top
SW2  16,22 90 top
SW3  24,22 90 top
SW4  28.5,6 180 top
SW5  19.09,6.37 0 top
SW6  28.19,13.39 0 top
SW7  38.39,5.81 0 top
T1  10,75 180 top
T_GPIO  18,57 180 top
T_I2C1  5,46 90 top
T_SPI1  84,18 90 top
T_SPI2  139,4 0 top
U$1  [3,0]  5,95 0 top
U$2  [3,0]  155,95 0 top
U$20  [3,0]  5,5 0 top
U$21  [3,0]  155,5 0 top
USB  21,96 270 top
VCC  6,66 180 top

### Tracks (layer width: path | path; a pad name or v marks a point on that pad's centre or on a via)
12  (4 unrouted)
+3V3  (17 unrouted)
A1  (1 unrouted)
A1LED4  (1 unrouted)
A1LED5  (1 unrouted)
A2  (3 unrouted)
A3  (3 unrouted)
A4  (2 unrouted)
A5  (2 unrouted)
A6  (2 unrouted)
A7  (2 unrouted)
A11  (1 unrouted)
A14  (2 unrouted)
A17  (2 unrouted)
A18  (1 unrouted)
A19  (1 unrouted)
A20  (1 unrouted)
A21  (1 unrouted)
A23  (1 unrouted)
A31  (1 unrouted)
B25KEY1  (4 unrouted)
B25KEY2  (4 unrouted)
B25KEY3  (4 unrouted)
B25KEY4  (4 unrouted)
BOOST2  (2 unrouted)
BOOST3  (3 unrouted)
BOOSTIN  (4 unrouted)
CONLED  (1 unrouted)
D+  (4 unrouted)
D+PULLUP1  (2 unrouted)
D+PULLUP2  (2 unrouted)
D-  (5 unrouted)
DM  (2 unrouted)
DP  (2 unrouted)
GND  (68 unrouted)
  pour Bottom: 123,2 123,98 10,98 10,90 2,90 2,10 10,10 10,1 123,1
  pour Top: 123,1 123,98 10,98 10,90 2,90 2,10 10,10 10,1
GNDBOOST  (5 unrouted)
GNDSUPPLY  (12 unrouted)
GPA0  (1 unrouted)
GPA1  (1 unrouted)
GPA2  (1 unrouted)
GPA3  (1 unrouted)
GPA4  (1 unrouted)
GPA5  (1 unrouted)
GPA6  (1 unrouted)
GPA7  (1 unrouted)
GPB0  (2 unrouted)
GPB1  (2 unrouted)
GPB2  (2 unrouted)
GPB3  (2 unrouted)
GPB4  (3 unrouted)
GPB5  (3 unrouted)
GPB6  (1 unrouted)
GPB7  (1 unrouted)
JBSL  (1 unrouted)
JDEB  (1 unrouted)
JTAG17  (1 unrouted)
JTAG19  (1 unrouted)
LED1  (1 unrouted)
LED4  (1 unrouted)
MRSWITCH  (2 unrouted)
N$1  (1 unrouted)
N$4  (1 unrouted)
N$5  (1 unrouted)
N$6  (1 unrouted)
N$7  (1 unrouted)
N$8  (1 unrouted)
N$9  (2 unrouted)
N$19  (1 unrouted)
RESET  (2 unrouted)
RTCK  (2 unrouted)
RX1  (2 unrouted)
RX2  (2 unrouted)
RX3  (1 unrouted)
TCK  (2 unrouted)
TDI  (via drill 0.6)  (1 unrouted)
  Top 0.254: R7.1 63.4,84.95 v63.4,77.2 | 68.8,62.8 68.8,62.7 | 68.8,62.8 IC9.60 | v68.7,64.4 68.8,64.4 68.8,62.8
  Bottom 0.254: v63.4,77.2 58.6,77.2 58.6,64.2 68.7,64.2 v68.7,64.4
TDO  (2 unrouted)
TMS  (2 unrouted)
TRST  (3 unrouted)
USBSENSE  (2 unrouted)
V5V  (2 unrouted)
VCCCPU  (15 unrouted)
VCCLED  (1 unrouted)
VCCREF  (3 unrouted)
VCCSUPPLY  (7 unrouted)
VCCUSB1  (3 unrouted)
VUSB  (2 unrouted)
X1  (2 unrouted)
X2  (2 unrouted)

### Text on the board
tPlace: SCL | SDA | GND | GND | SEL | MOSI | MISO | SCK | GN | CK | MI | MO | CS1 | CS2
tNames: BUZZI-19c | DEB | BSL